# Altium project MEZZANINE-BOARD.PrjPcb
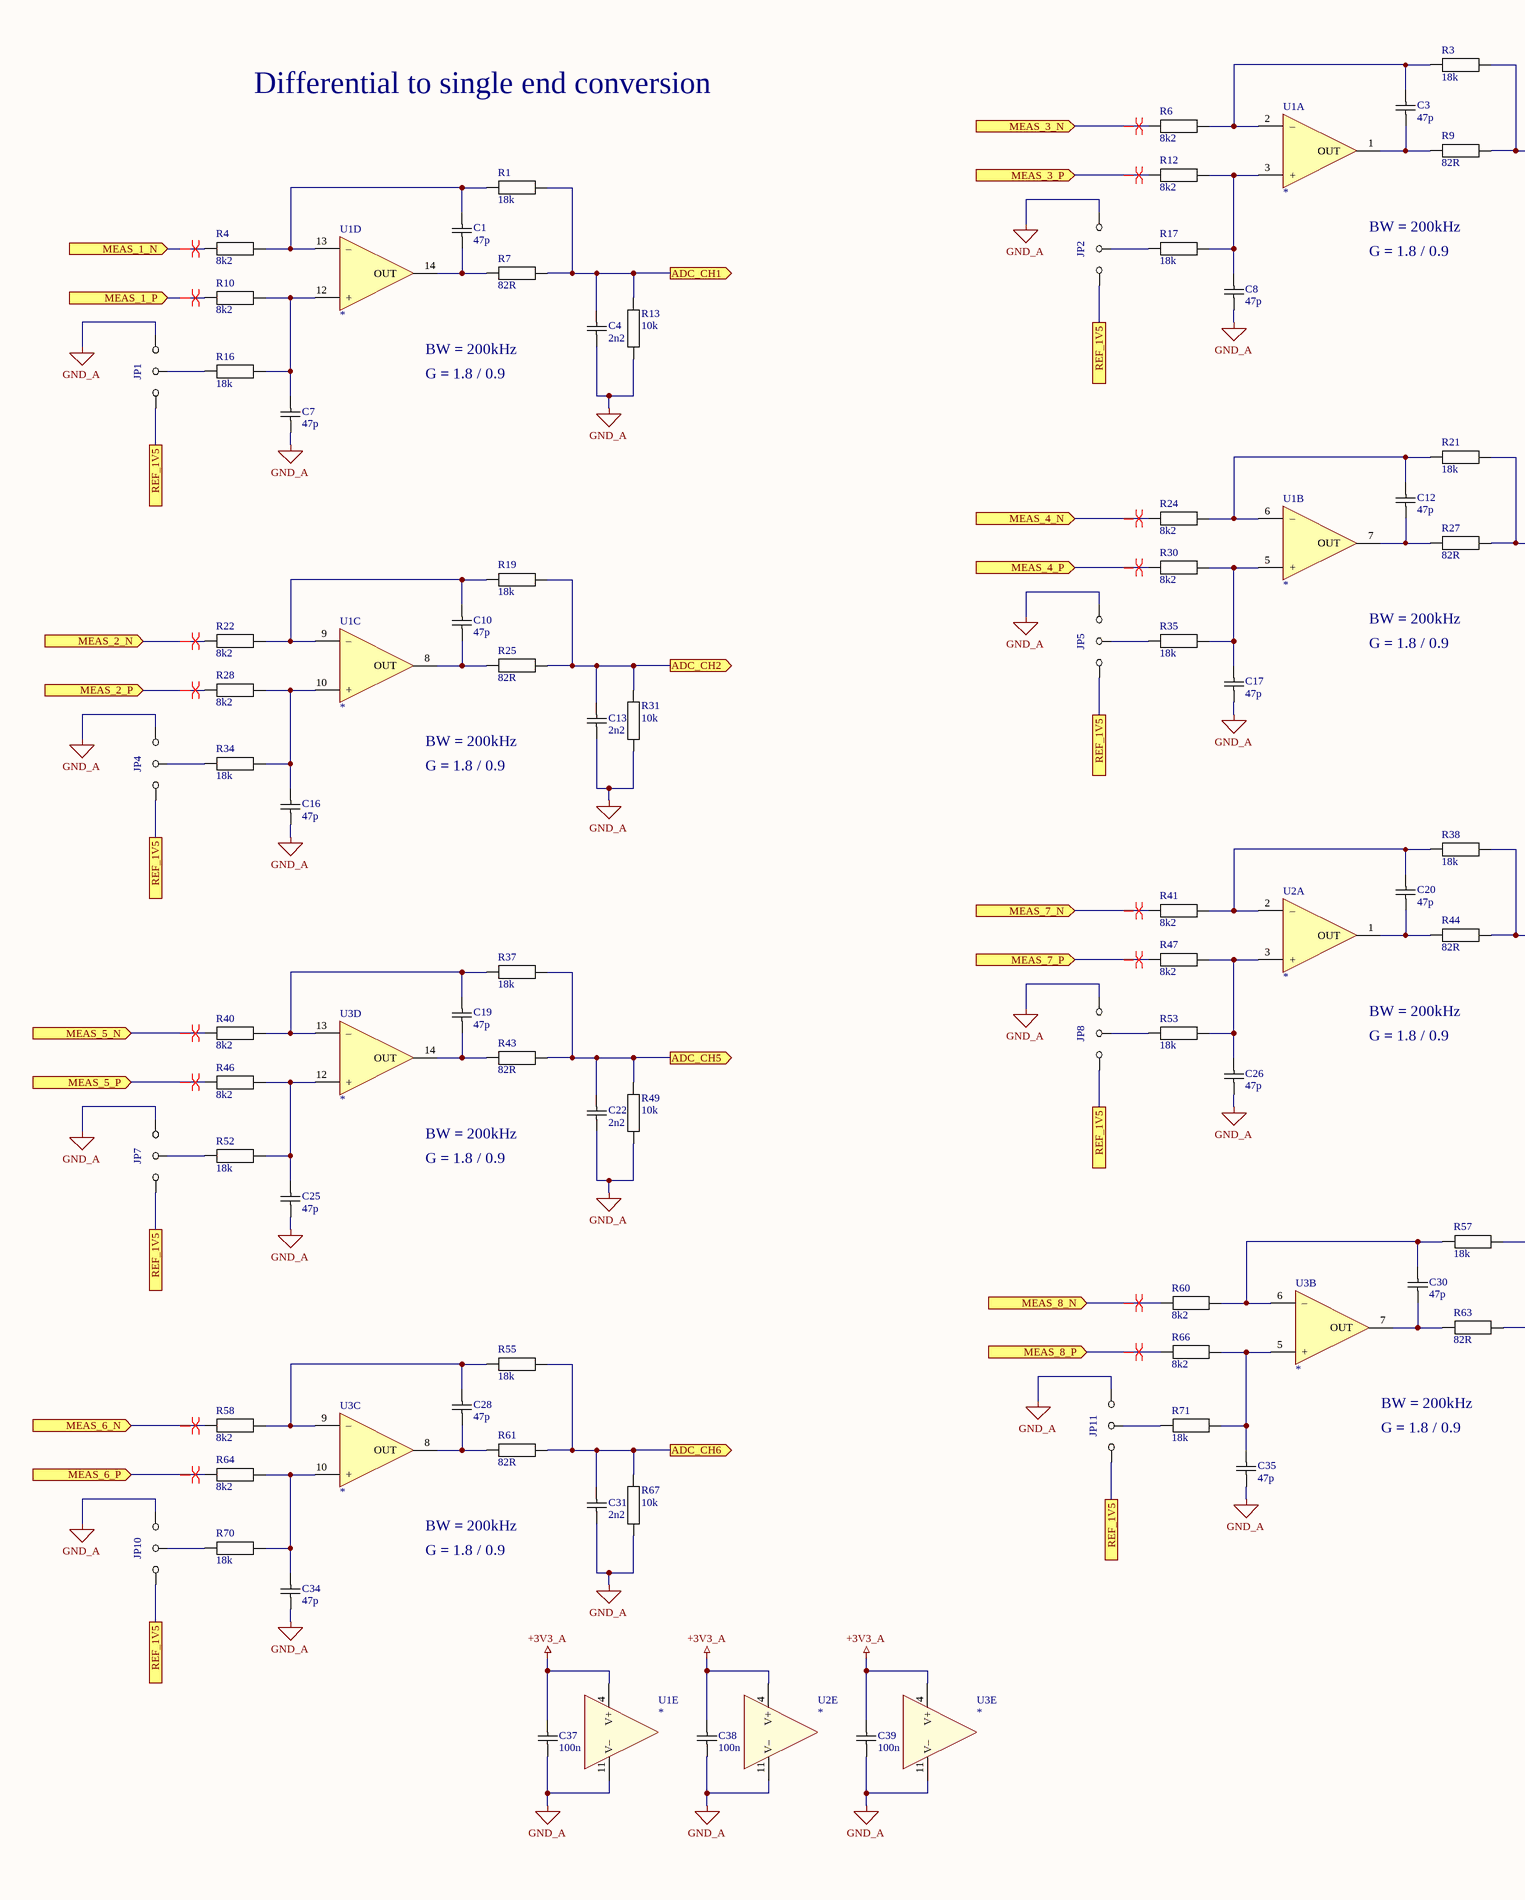
[diagram p0: AD_0.SchDoc, left]
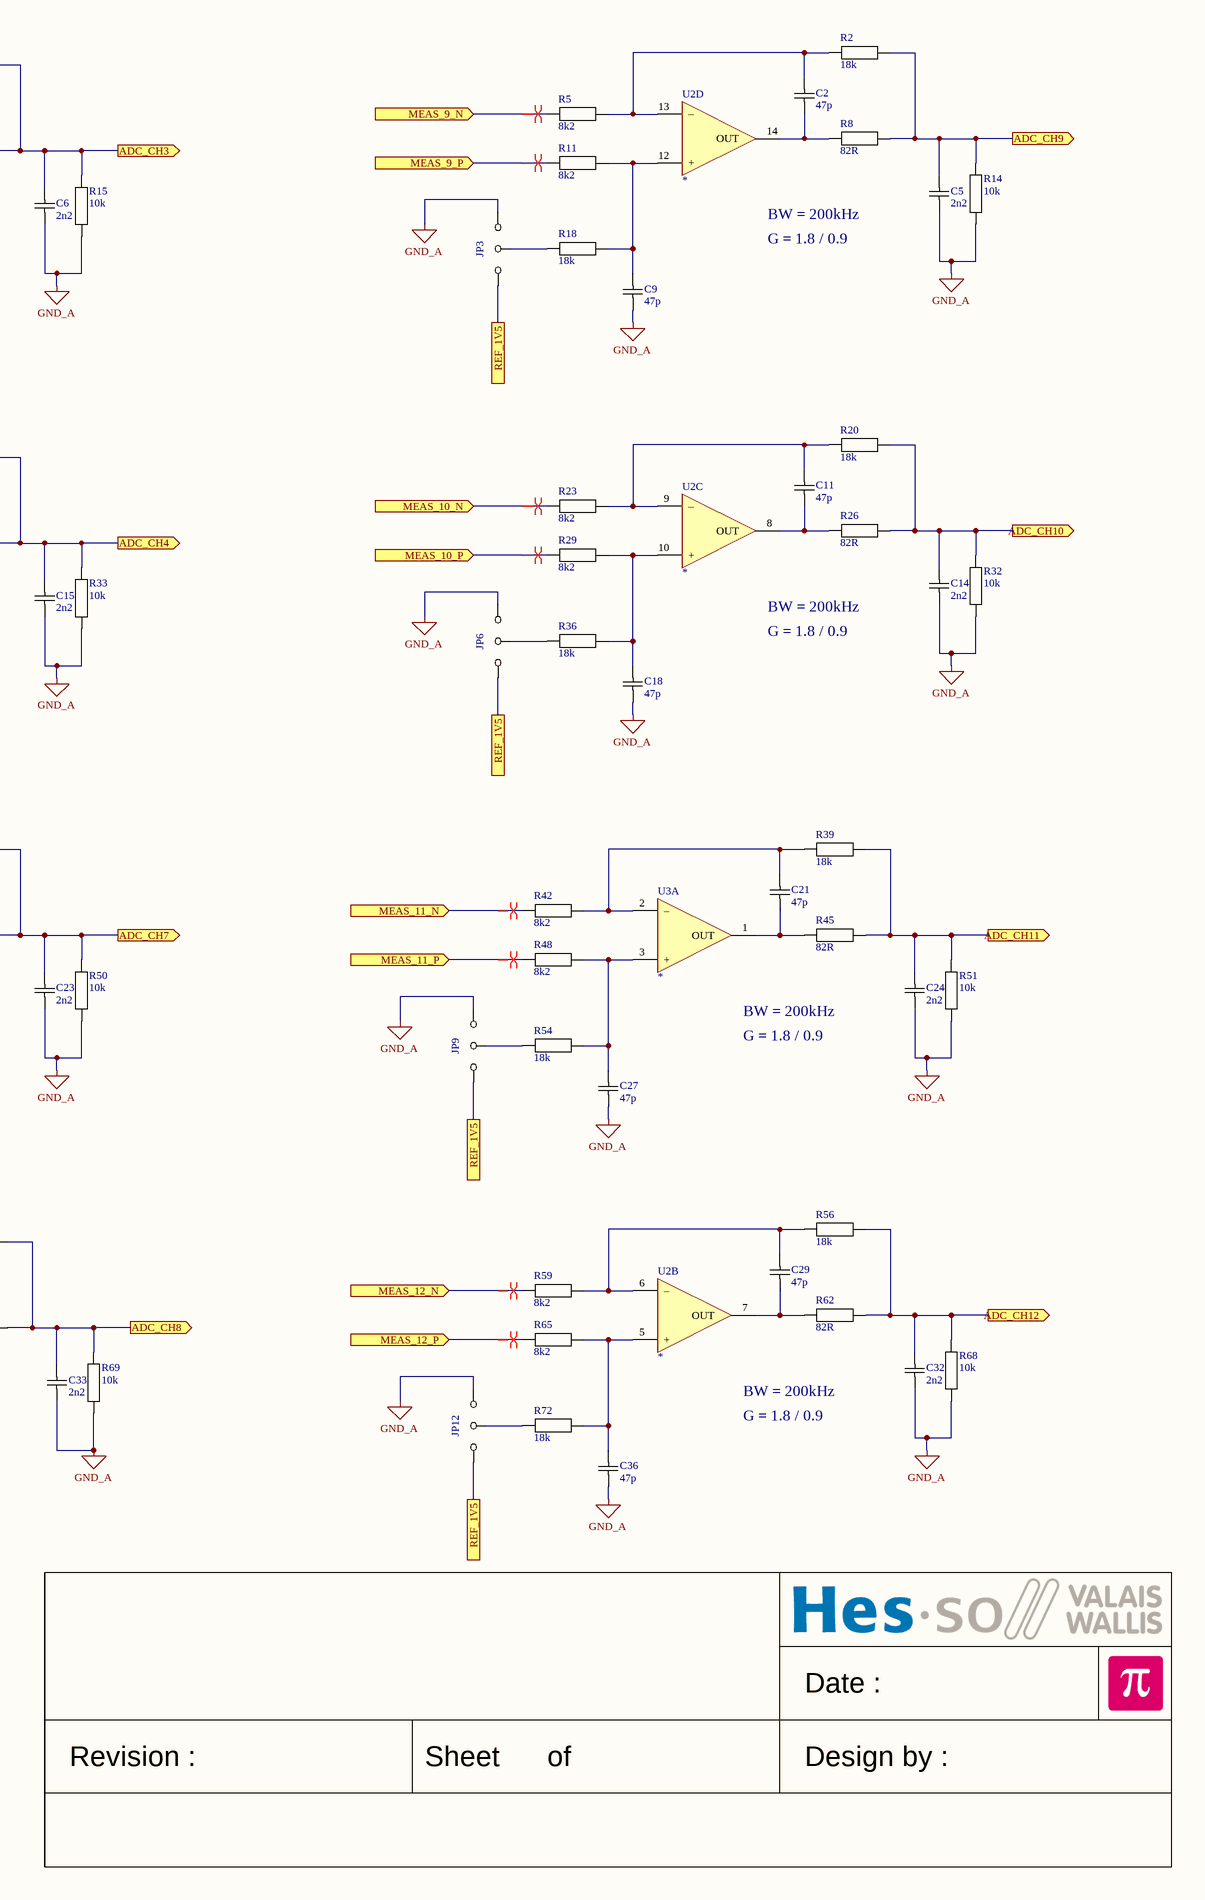
[diagram p1: AD_0.SchDoc, right]
6 sheets, 361 parts. Net scope: flat (ports and power ports of the same name join across sheets).
Board file: PCB-Mezzanine.PcbDoc
Sheets:
  AD_0.SchDoc
  AD_1.SchDoc
  AD_3.SchDoc
  Connector_0.SchDoc
  Supply_0.SchDoc
  DAC_0.SchDoc

## Sheet AD_0.SchDoc
size A2; Date: Date; CompanyName: HESSO; Engineer: Name; Address1: Route du Rawyl 47; Address2: 1950 Sion; Address3: Switzerland; ProjectName: Project Name

### Parts
C1  47p  [CAPACITOR 1608 REFLOW]
C2  47p  [CAPACITOR 1608 REFLOW]
C3  47p  [CAPACITOR 1608 REFLOW]
C4  2n2  [CAPACITOR 1608 REFLOW]
C5  2n2  [CAPACITOR 1608 REFLOW]
C6  2n2  [CAPACITOR 1608 REFLOW]
C7  47p  [CAPACITOR 1608 REFLOW]
C8  47p  [CAPACITOR 1608 REFLOW]
C9  47p  [CAPACITOR 1608 REFLOW]
C10  47p  [CAPACITOR 1608 REFLOW]
C11  47p  [CAPACITOR 1608 REFLOW]
C12  47p  [CAPACITOR 1608 REFLOW]
C13  2n2  [CAPACITOR 1608 REFLOW]
C14  2n2  [CAPACITOR 1608 REFLOW]
C15  2n2  [CAPACITOR 1608 REFLOW]
C16  47p  [CAPACITOR 1608 REFLOW]
C17  47p  [CAPACITOR 1608 REFLOW]
C18  47p  [CAPACITOR 1608 REFLOW]
C19  47p  [CAPACITOR 1608 REFLOW]
C20  47p  [CAPACITOR 1608 REFLOW]
C21  47p  [CAPACITOR 1608 REFLOW]
C22  2n2  [CAPACITOR 1608 REFLOW]
C23  2n2  [CAPACITOR 1608 REFLOW]
C24  2n2  [CAPACITOR 1608 REFLOW]
C25  47p  [CAPACITOR 1608 REFLOW]
C26  47p  [CAPACITOR 1608 REFLOW]
C27  47p  [CAPACITOR 1608 REFLOW]
C28  47p  [CAPACITOR 1608 REFLOW]
C29  47p  [CAPACITOR 1608 REFLOW]
C30  47p  [CAPACITOR 1608 REFLOW]
C31  2n2  [CAPACITOR 1608 REFLOW]
C32  2n2  [CAPACITOR 1608 REFLOW]
C33  2n2  [CAPACITOR 1608 REFLOW]
C34  47p  [CAPACITOR 1608 REFLOW]
C35  47p  [CAPACITOR 1608 REFLOW]
C36  47p  [CAPACITOR 1608 REFLOW]
C37  100n  [CAPACITOR 1608 REFLOW]
C38  100n  [CAPACITOR 1608 REFLOW]
C39  100n  [CAPACITOR 1608 REFLOW]
JP1  {Value}  [JUMPER3 SMD 1608]  (value not drawn)
JP2  {Value}  [JUMPER3 SMD 1608]  (value not drawn)
JP3  {Value}  [JUMPER3 SMD 1608]  (value not drawn)
JP4  {Value}  [JUMPER3 SMD 1608]  (value not drawn)
JP5  {Value}  [JUMPER3 SMD 1608]  (value not drawn)
JP6  {Value}  [JUMPER3 SMD 1608]  (value not drawn)
JP7  {Value}  [JUMPER3 SMD 1608]  (value not drawn)
JP8  {Value}  [JUMPER3 SMD 1608]  (value not drawn)
JP9  {Value}  [JUMPER3 SMD 1608]  (value not drawn)
JP10  {Value}  [JUMPER3 SMD 1608]  (value not drawn)
JP11  {Value}  [JUMPER3 SMD 1608]  (value not drawn)
JP12  {Value}  [JUMPER3 SMD 1608]  (value not drawn)
R1  18k  [RESISTOR 1608 REFLOW]
R2  18k  [RESISTOR 1608 REFLOW]
R3  18k  [RESISTOR 1608 REFLOW]
R4  8k2  [RESISTOR 1608 REFLOW]
R5  8k2  [RESISTOR 1608 REFLOW]
R6  8k2  [RESISTOR 1608 REFLOW]
R7  82R  [RESISTOR 1608 REFLOW]
R8  82R  [RESISTOR 1608 REFLOW]
R9  82R  [RESISTOR 1608 REFLOW]
R10  8k2  [RESISTOR 1608 REFLOW]
R11  8k2  [RESISTOR 1608 REFLOW]
R12  8k2  [RESISTOR 1608 REFLOW]
R13  10k  [RESISTOR 1608 REFLOW]
R14  10k  [RESISTOR 1608 REFLOW]
R15  10k  [RESISTOR 1608 REFLOW]
R16  18k  [RESISTOR 1608 REFLOW]
R17  18k  [RESISTOR 1608 REFLOW]
R18  18k  [RESISTOR 1608 REFLOW]
R19  18k  [RESISTOR 1608 REFLOW]
R20  18k  [RESISTOR 1608 REFLOW]
R21  18k  [RESISTOR 1608 REFLOW]
R22  8k2  [RESISTOR 1608 REFLOW]
R23  8k2  [RESISTOR 1608 REFLOW]
R24  8k2  [RESISTOR 1608 REFLOW]
R25  82R  [RESISTOR 1608 REFLOW]
R26  82R  [RESISTOR 1608 REFLOW]
R27  82R  [RESISTOR 1608 REFLOW]
R28  8k2  [RESISTOR 1608 REFLOW]
R29  8k2  [RESISTOR 1608 REFLOW]
R30  8k2  [RESISTOR 1608 REFLOW]
R31  10k  [RESISTOR 1608 REFLOW]
R32  10k  [RESISTOR 1608 REFLOW]
R33  10k  [RESISTOR 1608 REFLOW]
R34  18k  [RESISTOR 1608 REFLOW]
R35  18k  [RESISTOR 1608 REFLOW]
R36  18k  [RESISTOR 1608 REFLOW]
R37  18k  [RESISTOR 1608 REFLOW]
R38  18k  [RESISTOR 1608 REFLOW]
R39  18k  [RESISTOR 1608 REFLOW]
R40  8k2  [RESISTOR 1608 REFLOW]
R41  8k2  [RESISTOR 1608 REFLOW]
R42  8k2  [RESISTOR 1608 REFLOW]
R43  82R  [RESISTOR 1608 REFLOW]
R44  82R  [RESISTOR 1608 REFLOW]
R45  82R  [RESISTOR 1608 REFLOW]
R46  8k2  [RESISTOR 1608 REFLOW]
R47  8k2  [RESISTOR 1608 REFLOW]
R48  8k2  [RESISTOR 1608 REFLOW]
R49  10k  [RESISTOR 1608 REFLOW]
R50  10k  [RESISTOR 1608 REFLOW]
R51  10k  [RESISTOR 1608 REFLOW]
R52  18k  [RESISTOR 1608 REFLOW]
R53  18k  [RESISTOR 1608 REFLOW]
R54  18k  [RESISTOR 1608 REFLOW]
R55  18k  [RESISTOR 1608 REFLOW]
R56  18k  [RESISTOR 1608 REFLOW]
R57  18k  [RESISTOR 1608 REFLOW]
R58  8k2  [RESISTOR 1608 REFLOW]
R59  8k2  [RESISTOR 1608 REFLOW]
R60  8k2  [RESISTOR 1608 REFLOW]
R61  82R  [RESISTOR 1608 REFLOW]
R62  82R  [RESISTOR 1608 REFLOW]
R63  82R  [RESISTOR 1608 REFLOW]
R64  8k2  [RESISTOR 1608 REFLOW]
R65  8k2  [RESISTOR 1608 REFLOW]
R66  8k2  [RESISTOR 1608 REFLOW]
R67  10k  [RESISTOR 1608 REFLOW]
R68  10k  [RESISTOR 1608 REFLOW]
R69  10k  [RESISTOR 1608 REFLOW]
R70  18k  [RESISTOR 1608 REFLOW]
R71  18k  [RESISTOR 1608 REFLOW]
R72  18k  [RESISTOR 1608 REFLOW]
U1  *  [SO14 P1.27 C4.0X8.8 H1.75]  (parts A,B,C,D,E of 5)
U2  *  [SO14 P1.27 C4.0X8.8 H1.75]  (parts A,B,C,D,E of 5)
U3  *  [SO14 P1.27 C4.0X8.8 H1.75]  (parts A,B,C,D,E of 5)

### Ports
ADC_CH1 (out), ADC_CH2 (out), ADC_CH3 (out), ADC_CH4 (out), ADC_CH5 (out), ADC_CH6 (out), ADC_CH7 (out), ADC_CH8 (out), ADC_CH9 (out), ADC_CH10 (out), ADC_CH11 (out), ADC_CH12 (out), MEAS_1_N (in), MEAS_1_P (in), MEAS_2_N (in), MEAS_2_P (in), MEAS_3_N (in), MEAS_3_P (in), MEAS_4_N (in), MEAS_4_P (in), MEAS_5_N (in), MEAS_5_P (in), MEAS_6_N (in), MEAS_6_P (in), MEAS_7_N (in), MEAS_7_P (in), MEAS_8_N (in), MEAS_8_P (in), MEAS_9_N (in), MEAS_9_P (in), MEAS_10_N (in), MEAS_10_P (in), MEAS_11_N (in), MEAS_11_P (in), MEAS_12_N (in), MEAS_12_P (in), REF_1V5

### Nets
+3V3_A: C37.2 C38.2 C39.2 U1.4(V+) U2.4(V+) U3.4(V+)
GND_A: C4.1 C5.1 C6.1 C7.1 C8.1 C9.1 C13.1 C14.1 C15.1 C16.1 C17.1 C18.1 C22.1 C23.1 C24.1 C25.1 C26.1 C27.1 C31.1 C32.1 C33.1 C34.1 C35.1 C36.1 C37.1 C38.1 C39.1 JP1.3 JP2.3 JP3.3 JP4.3 JP5.3 JP6.3 JP7.3 JP8.3 JP9.3 JP10.3 JP11.3 JP12.3 R13.2 R14.2 R15.2 R31.2 R32.2 R33.2 R49.2 R50.2 R51.2 R67.2 R68.2 R69.2 U1.11(V–) U2.11(V–) U3.11(V–)
ADC_CH1: C4.2 R1.2 R7.2 R13.1 ; port ADC_CH1
ADC_CH2: C13.2 R19.2 R25.2 R31.1 ; port ADC_CH2
ADC_CH3: C6.2 R3.2 R9.2 R15.1 ; port ADC_CH3
ADC_CH4: C15.2 R21.2 R27.2 R33.1 ; port ADC_CH4
ADC_CH5: C22.2 R37.2 R43.2 R49.1 ; port ADC_CH5
ADC_CH6: C31.2 R55.2 R61.2 R67.1 ; port ADC_CH6
ADC_CH7: C23.2 R38.2 R44.2 R50.1 ; port ADC_CH7
ADC_CH8: C33.2 R57.2 R63.2 R69.1 ; port ADC_CH8
ADC_CH9: C5.2 R2.2 R8.2 R14.1 ; port ADC_CH9
ADC_CH10: C14.2 R20.2 R26.2 R32.1 ; port ADC_CH10
ADC_CH11: C24.2 R39.2 R45.2 R51.1 ; port ADC_CH11
ADC_CH12: C32.2 R56.2 R62.2 R68.1 ; port ADC_CH12
MEAS_1_N: R4.1 ; port MEAS_1_N
MEAS_1_P: R10.1 ; port MEAS_1_P
MEAS_2_N: R22.1 ; port MEAS_2_N
MEAS_2_P: R28.1 ; port MEAS_2_P
MEAS_3_N: R6.1 ; port MEAS_3_N
MEAS_3_P: R12.1 ; port MEAS_3_P
MEAS_4_N: R24.1 ; port MEAS_4_N
MEAS_4_P: R30.1 ; port MEAS_4_P
MEAS_5_N: R40.1 ; port MEAS_5_N
MEAS_5_P: R46.1 ; port MEAS_5_P
MEAS_6_N: R58.1 ; port MEAS_6_N
MEAS_6_P: R64.1 ; port MEAS_6_P
MEAS_7_N: R41.1 ; port MEAS_7_N
MEAS_7_P: R47.1 ; port MEAS_7_P
MEAS_8_N: R60.1 ; port MEAS_8_N
MEAS_8_P: R66.1 ; port MEAS_8_P
MEAS_9_N: R5.1 ; port MEAS_9_N
MEAS_9_P: R11.1 ; port MEAS_9_P
MEAS_10_N: R23.1 ; port MEAS_10_N
MEAS_10_P: R29.1 ; port MEAS_10_P
MEAS_11_N: R42.1 ; port MEAS_11_N
MEAS_11_P: R48.1 ; port MEAS_11_P
MEAS_12_N: R59.1 ; port MEAS_12_N
MEAS_12_P: R65.1 ; port MEAS_12_P
REF_1V5: JP1.1 JP2.1 JP3.1 JP4.1 JP5.1 JP6.1 JP7.1 JP8.1 JP9.1 JP10.1 JP11.1 JP12.1 ; port REF_1V5
NetC1_1: C1.1 R7.1 U1.14(OUT)
NetC1_2: C1.2 R1.1 R4.2 U1.13(–)
NetC2_1: C2.1 R8.1 U2.14(OUT)
NetC2_2: C2.2 R2.1 R5.2 U2.13(–)
NetC3_1: C3.1 R9.1 U1.1(OUT)
NetC3_2: C3.2 R3.1 R6.2 U1.2(–)
NetC7_2: C7.2 R10.2 R16.1 U1.12(+)
NetC8_2: C8.2 R12.2 R17.1 U1.3(+)
NetC9_2: C9.2 R11.2 R18.1 U2.12(+)
NetC10_1: C10.1 R25.1 U1.8(OUT)
NetC10_2: C10.2 R19.1 R22.2 U1.9(–)
NetC11_1: C11.1 R26.1 U2.8(OUT)
NetC11_2: C11.2 R20.1 R23.2 U2.9(–)
NetC12_1: C12.1 R27.1 U1.7(OUT)
NetC12_2: C12.2 R21.1 R24.2 U1.6(–)
NetC16_2: C16.2 R28.2 R34.1 U1.10(+)
NetC17_2: C17.2 R30.2 R35.1 U1.5(+)
NetC18_2: C18.2 R29.2 R36.1 U2.10(+)
NetC19_1: C19.1 R43.1 U3.14(OUT)
NetC19_2: C19.2 R37.1 R40.2 U3.13(–)
NetC20_1: C20.1 R44.1 U2.1(OUT)
NetC20_2: C20.2 R38.1 R41.2 U2.2(–)
NetC21_1: C21.1 R45.1 U3.1(OUT)
NetC21_2: C21.2 R39.1 R42.2 U3.2(–)
NetC25_2: C25.2 R46.2 R52.1 U3.12(+)
NetC26_2: C26.2 R47.2 R53.1 U2.3(+)
NetC27_2: C27.2 R48.2 R54.1 U3.3(+)
NetC28_1: C28.1 R61.1 U3.8(OUT)
NetC28_2: C28.2 R55.1 R58.2 U3.9(–)
NetC29_1: C29.1 R62.1 U2.7(OUT)
NetC29_2: C29.2 R56.1 R59.2 U2.6(–)
NetC30_1: C30.1 R63.1 U3.7(OUT)
NetC30_2: C30.2 R57.1 R60.2 U3.6(–)
NetC34_2: C34.2 R64.2 R70.1 U3.10(+)
NetC35_2: C35.2 R66.2 R71.1 U3.5(+)
NetC36_2: C36.2 R65.2 R72.1 U2.5(+)
NetJP1_2: JP1.2 R16.2
NetJP2_2: JP2.2 R17.2
NetJP3_2: JP3.2 R18.2
NetJP4_2: JP4.2 R34.2
NetJP5_2: JP5.2 R35.2
NetJP6_2: JP6.2 R36.2
NetJP7_2: JP7.2 R52.2
NetJP8_2: JP8.2 R53.2
NetJP9_2: JP9.2 R54.2
NetJP10_2: JP10.2 R70.2
NetJP11_2: JP11.2 R71.2
NetJP12_2: JP12.2 R72.2

### Layout directives
differential pair: MEAS_1_N, MEAS_1_P, MEAS_2_N, MEAS_2_P, MEAS_3_N, MEAS_3_P, MEAS_4_N, MEAS_4_P, MEAS_5_N, MEAS_5_P, MEAS_6_N, MEAS_6_P, MEAS_7_N, MEAS_7_P, MEAS_8_N, MEAS_8_P, MEAS_9_N, MEAS_9_P, MEAS_10_N, MEAS_10_P, MEAS_11_N, MEAS_11_P, MEAS_12_N, MEAS_12_P

### Notes on the sheet
- Differential to single end conversion
- BW = 200kHz
- G = 1.8 / 0.9
- Date :
- Revision :
- Sheet
- of
- Design by :

### Library data of the parts
C1-C39 = Capacitor: Capacitor X7R 10% 50V 1608(0603)
  C1-C3 C7-C12 C16-C21 C25-C30 C34-C36: Value: 47p
  C4-C6 C13-C15 C22-C24 C31-C33: Value: 2n2
  C37-C39: Value: 100n
JP1-JP12 = JUMPER 3 POS: Value: {Value}
R1-R72 = Resistor: Resistor 1% 50V 100mW 1608(0603)
  R1-R3 R16-R21 R34-R39 R52-R57 R70-R72: Value: 18k
  R4-R6 R10-R12 R22-R24 R28-R30 R40-R42 R46-R48 R58-R60 R64-R66: Value: 8k2
  R7-R9 R25-R27 R43-R45 R61-R63: Value: 82R
  R13-R15 R31-R33 R49-R51 R67-R69: Value: 10k
U1-U3 = OPA QUAD: Generic quad OPA 14 pins; Value: *

## Sheet AD_1.SchDoc
size A2; Date: Date; CompanyName: HESSO; Engineer: Name; Address1: Route du Rawyl 47; Address2: 1950 Sion; Address3: Switzerland; ProjectName: Project Name
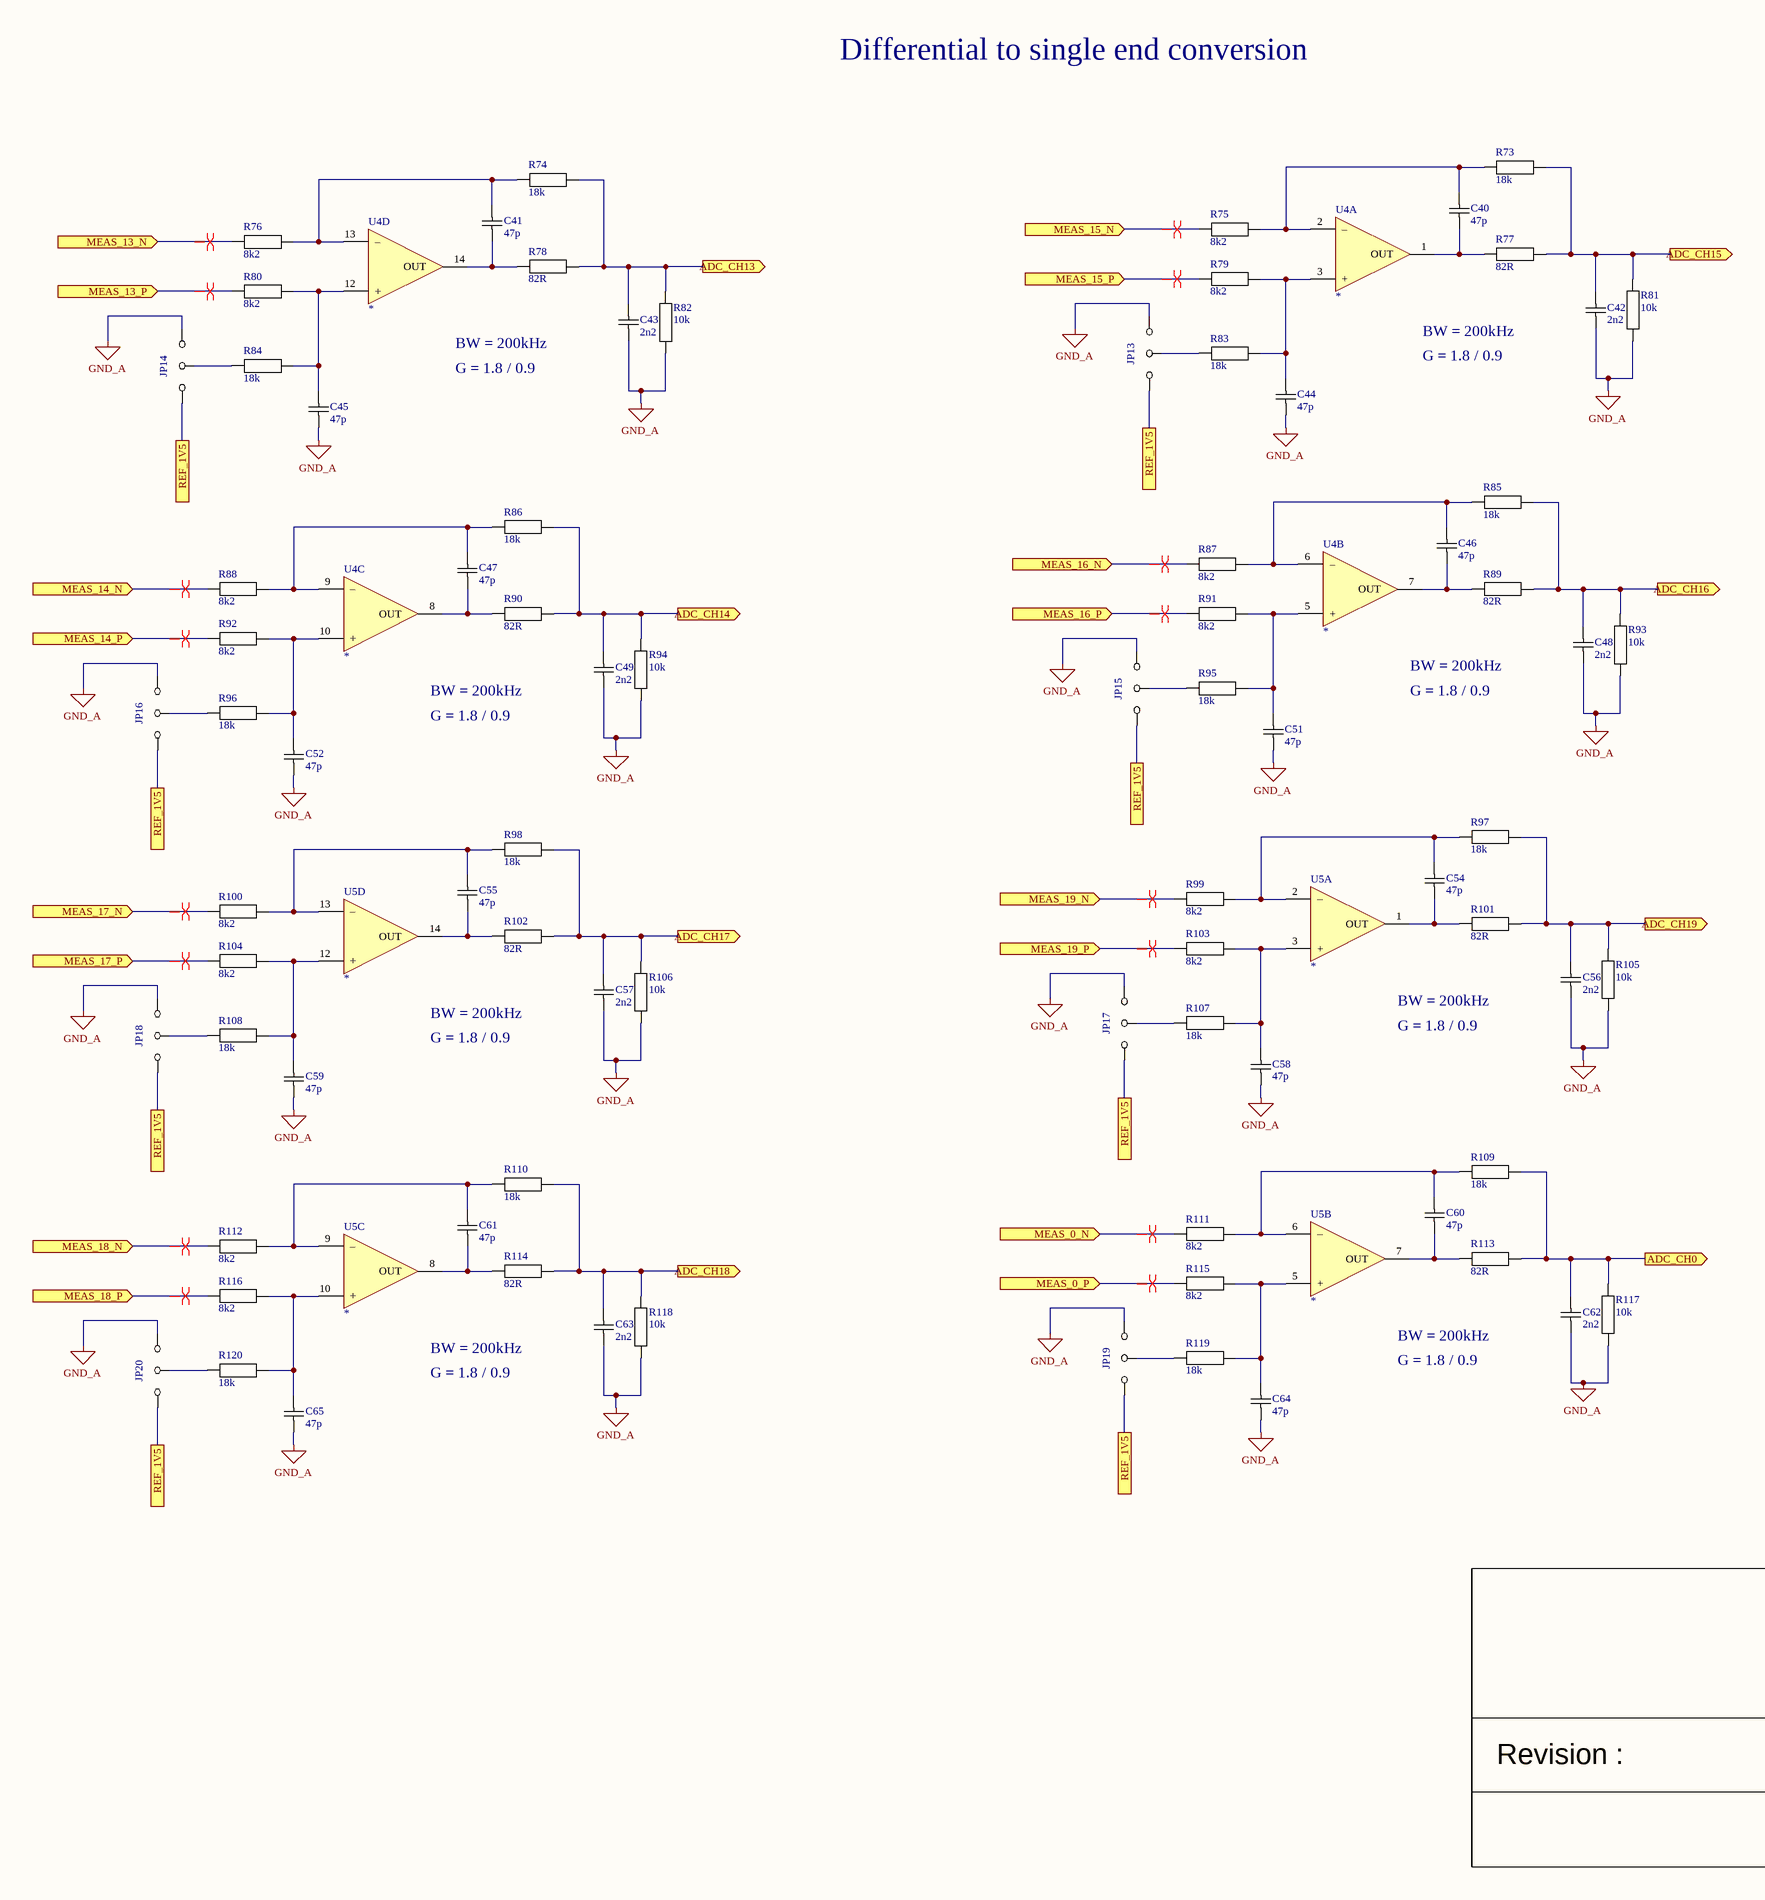
[diagram p2: AD_1.SchDoc, left]
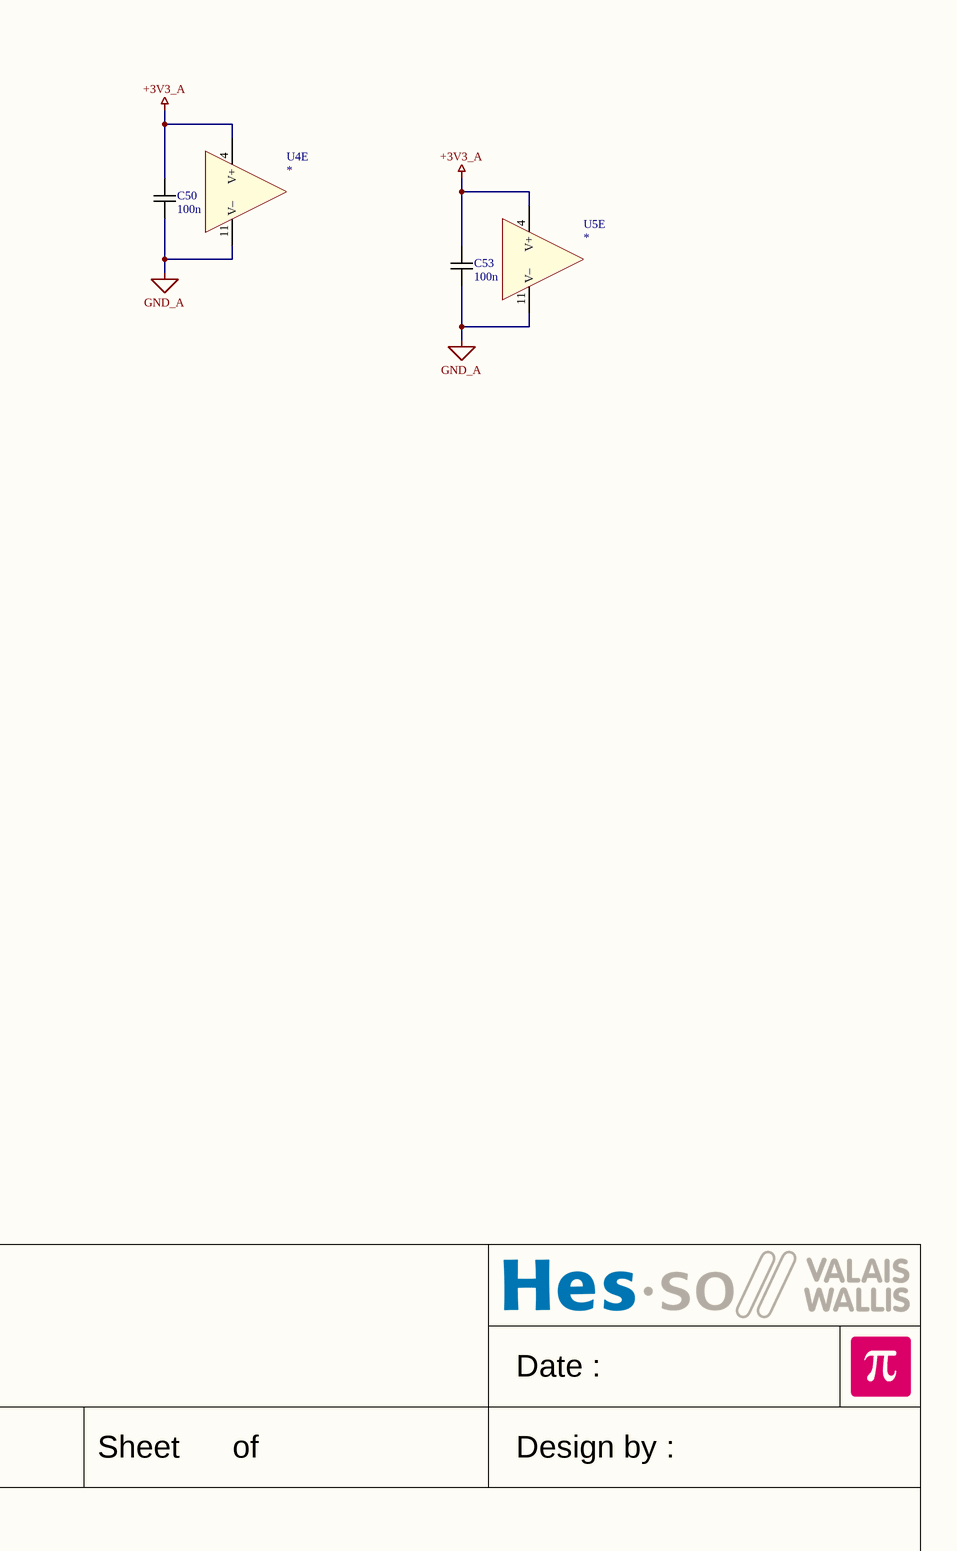
[diagram p3: AD_1.SchDoc, right]

### Parts
C40  47p  [CAPACITOR 1608 REFLOW]
C41  47p  [CAPACITOR 1608 REFLOW]
C42  2n2  [CAPACITOR 1608 REFLOW]
C43  2n2  [CAPACITOR 1608 REFLOW]
C44  47p  [CAPACITOR 1608 REFLOW]
C45  47p  [CAPACITOR 1608 REFLOW]
C46  47p  [CAPACITOR 1608 REFLOW]
C47  47p  [CAPACITOR 1608 REFLOW]
C48  2n2  [CAPACITOR 1608 REFLOW]
C49  2n2  [CAPACITOR 1608 REFLOW]
C50  100n  [CAPACITOR 1608 REFLOW]
C51  47p  [CAPACITOR 1608 REFLOW]
C52  47p  [CAPACITOR 1608 REFLOW]
C53  100n  [CAPACITOR 1608 REFLOW]
C54  47p  [CAPACITOR 1608 REFLOW]
C55  47p  [CAPACITOR 1608 REFLOW]
C56  2n2  [CAPACITOR 1608 REFLOW]
C57  2n2  [CAPACITOR 1608 REFLOW]
C58  47p  [CAPACITOR 1608 REFLOW]
C59  47p  [CAPACITOR 1608 REFLOW]
C60  47p  [CAPACITOR 1608 REFLOW]
C61  47p  [CAPACITOR 1608 REFLOW]
C62  2n2  [CAPACITOR 1608 REFLOW]
C63  2n2  [CAPACITOR 1608 REFLOW]
C64  47p  [CAPACITOR 1608 REFLOW]
C65  47p  [CAPACITOR 1608 REFLOW]
JP13  {Value}  [JUMPER3 SMD 1608]  (value not drawn)
JP14  {Value}  [JUMPER3 SMD 1608]  (value not drawn)
JP15  {Value}  [JUMPER3 SMD 1608]  (value not drawn)
JP16  {Value}  [JUMPER3 SMD 1608]  (value not drawn)
JP17  {Value}  [JUMPER3 SMD 1608]  (value not drawn)
JP18  {Value}  [JUMPER3 SMD 1608]  (value not drawn)
JP19  {Value}  [JUMPER3 SMD 1608]  (value not drawn)
JP20  {Value}  [JUMPER3 SMD 1608]  (value not drawn)
R73  18k  [RESISTOR 1608 REFLOW]
R74  18k  [RESISTOR 1608 REFLOW]
R75  8k2  [RESISTOR 1608 REFLOW]
R76  8k2  [RESISTOR 1608 REFLOW]
R77  82R  [RESISTOR 1608 REFLOW]
R78  82R  [RESISTOR 1608 REFLOW]
R79  8k2  [RESISTOR 1608 REFLOW]
R80  8k2  [RESISTOR 1608 REFLOW]
R81  10k  [RESISTOR 1608 REFLOW]
R82  10k  [RESISTOR 1608 REFLOW]
R83  18k  [RESISTOR 1608 REFLOW]
R84  18k  [RESISTOR 1608 REFLOW]
R85  18k  [RESISTOR 1608 REFLOW]
R86  18k  [RESISTOR 1608 REFLOW]
R87  8k2  [RESISTOR 1608 REFLOW]
R88  8k2  [RESISTOR 1608 REFLOW]
R89  82R  [RESISTOR 1608 REFLOW]
R90  82R  [RESISTOR 1608 REFLOW]
R91  8k2  [RESISTOR 1608 REFLOW]
R92  8k2  [RESISTOR 1608 REFLOW]
R93  10k  [RESISTOR 1608 REFLOW]
R94  10k  [RESISTOR 1608 REFLOW]
R95  18k  [RESISTOR 1608 REFLOW]
R96  18k  [RESISTOR 1608 REFLOW]
R97  18k  [RESISTOR 1608 REFLOW]
R98  18k  [RESISTOR 1608 REFLOW]
R99  8k2  [RESISTOR 1608 REFLOW]
R100  8k2  [RESISTOR 1608 REFLOW]
R101  82R  [RESISTOR 1608 REFLOW]
R102  82R  [RESISTOR 1608 REFLOW]
R103  8k2  [RESISTOR 1608 REFLOW]
R104  8k2  [RESISTOR 1608 REFLOW]
R105  10k  [RESISTOR 1608 REFLOW]
R106  10k  [RESISTOR 1608 REFLOW]
R107  18k  [RESISTOR 1608 REFLOW]
R108  18k  [RESISTOR 1608 REFLOW]
R109  18k  [RESISTOR 1608 REFLOW]
R110  18k  [RESISTOR 1608 REFLOW]
R111  8k2  [RESISTOR 1608 REFLOW]
R112  8k2  [RESISTOR 1608 REFLOW]
R113  82R  [RESISTOR 1608 REFLOW]
R114  82R  [RESISTOR 1608 REFLOW]
R115  8k2  [RESISTOR 1608 REFLOW]
R116  8k2  [RESISTOR 1608 REFLOW]
R117  10k  [RESISTOR 1608 REFLOW]
R118  10k  [RESISTOR 1608 REFLOW]
R119  18k  [RESISTOR 1608 REFLOW]
R120  18k  [RESISTOR 1608 REFLOW]
U4  *  [SO14 P1.27 C4.0X8.8 H1.75]  (parts A,B,C,D,E of 5)
U5  *  [SO14 P1.27 C4.0X8.8 H1.75]  (parts A,B,C,D,E of 5)

### Ports
ADC_CH0 (out), ADC_CH13 (out), ADC_CH14 (out), ADC_CH15 (out), ADC_CH16 (out), ADC_CH17 (out), ADC_CH18 (out), ADC_CH19 (out), MEAS_0_N (in), MEAS_0_P (in), MEAS_13_N (in), MEAS_13_P (in), MEAS_14_N (in), MEAS_14_P (in), MEAS_15_N (in), MEAS_15_P (in), MEAS_16_N (in), MEAS_16_P (in), MEAS_17_N (in), MEAS_17_P (in), MEAS_18_N (in), MEAS_18_P (in), MEAS_19_N (in), MEAS_19_P (in), REF_1V5

### Nets
+3V3_A: C50.2 C53.2 U4.4(V+) U5.4(V+)
GND_A: C42.1 C43.1 C44.1 C45.1 C48.1 C49.1 C50.1 C51.1 C52.1 C53.1 C56.1 C57.1 C58.1 C59.1 C62.1 C63.1 C64.1 C65.1 JP13.3 JP14.3 JP15.3 JP16.3 JP17.3 JP18.3 JP19.3 JP20.3 R81.2 R82.2 R93.2 R94.2 R105.2 R106.2 R117.2 R118.2 U4.11(V–) U5.11(V–)
ADC_CH0: C62.2 R109.2 R113.2 R117.1 ; port ADC_CH0
ADC_CH13: C43.2 R74.2 R78.2 R82.1 ; port ADC_CH13
ADC_CH14: C49.2 R86.2 R90.2 R94.1 ; port ADC_CH14
ADC_CH15: C42.2 R73.2 R77.2 R81.1 ; port ADC_CH15
ADC_CH16: C48.2 R85.2 R89.2 R93.1 ; port ADC_CH16
ADC_CH17: C57.2 R98.2 R102.2 R106.1 ; port ADC_CH17
ADC_CH18: C63.2 R110.2 R114.2 R118.1 ; port ADC_CH18
ADC_CH19: C56.2 R97.2 R101.2 R105.1 ; port ADC_CH19
MEAS_0_N: R111.1 ; port MEAS_0_N
MEAS_0_P: R115.1 ; port MEAS_0_P
MEAS_13_N: R76.1 ; port MEAS_13_N
MEAS_13_P: R80.1 ; port MEAS_13_P
MEAS_14_N: R88.1 ; port MEAS_14_N
MEAS_14_P: R92.1 ; port MEAS_14_P
MEAS_15_N: R75.1 ; port MEAS_15_N
MEAS_15_P: R79.1 ; port MEAS_15_P
MEAS_16_N: R87.1 ; port MEAS_16_N
MEAS_16_P: R91.1 ; port MEAS_16_P
MEAS_17_N: R100.1 ; port MEAS_17_N
MEAS_17_P: R104.1 ; port MEAS_17_P
MEAS_18_N: R112.1 ; port MEAS_18_N
MEAS_18_P: R116.1 ; port MEAS_18_P
MEAS_19_N: R99.1 ; port MEAS_19_N
MEAS_19_P: R103.1 ; port MEAS_19_P
REF_1V5: JP13.1 JP14.1 JP15.1 JP16.1 JP17.1 JP18.1 JP19.1 JP20.1 ; port REF_1V5
NetC40_1: C40.1 R77.1 U4.1(OUT)
NetC40_2: C40.2 R73.1 R75.2 U4.2(–)
NetC41_1: C41.1 R78.1 U4.14(OUT)
NetC41_2: C41.2 R74.1 R76.2 U4.13(–)
NetC44_2: C44.2 R79.2 R83.1 U4.3(+)
NetC45_2: C45.2 R80.2 R84.1 U4.12(+)
NetC46_1: C46.1 R89.1 U4.7(OUT)
NetC46_2: C46.2 R85.1 R87.2 U4.6(–)
NetC47_1: C47.1 R90.1 U4.8(OUT)
NetC47_2: C47.2 R86.1 R88.2 U4.9(–)
NetC51_2: C51.2 R91.2 R95.1 U4.5(+)
NetC52_2: C52.2 R92.2 R96.1 U4.10(+)
NetC54_1: C54.1 R101.1 U5.1(OUT)
NetC54_2: C54.2 R97.1 R99.2 U5.2(–)
NetC55_1: C55.1 R102.1 U5.14(OUT)
NetC55_2: C55.2 R98.1 R100.2 U5.13(–)
NetC58_2: C58.2 R103.2 R107.1 U5.3(+)
NetC59_2: C59.2 R104.2 R108.1 U5.12(+)
NetC60_1: C60.1 R113.1 U5.7(OUT)
NetC60_2: C60.2 R109.1 R111.2 U5.6(–)
NetC61_1: C61.1 R114.1 U5.8(OUT)
NetC61_2: C61.2 R110.1 R112.2 U5.9(–)
NetC64_2: C64.2 R115.2 R119.1 U5.5(+)
NetC65_2: C65.2 R116.2 R120.1 U5.10(+)
NetJP13_2: JP13.2 R83.2
NetJP14_2: JP14.2 R84.2
NetJP15_2: JP15.2 R95.2
NetJP16_2: JP16.2 R96.2
NetJP17_2: JP17.2 R107.2
NetJP18_2: JP18.2 R108.2
NetJP19_2: JP19.2 R119.2
NetJP20_2: JP20.2 R120.2

### Layout directives
differential pair: MEAS_0_N, MEAS_0_P, MEAS_13_N, MEAS_13_P, MEAS_14_N, MEAS_14_P, MEAS_15_N, MEAS_15_P, MEAS_16_N, MEAS_16_P, MEAS_17_N, MEAS_17_P, MEAS_18_N, MEAS_18_P, MEAS_19_N, MEAS_19_P

### Notes on the sheet
- Differential to single end conversion
- BW = 200kHz
- G = 1.8 / 0.9
- Date :
- Revision :
- Sheet
- of
- Design by :

### Library data of the parts
C40-C65 = Capacitor: Capacitor X7R 10% 50V 1608(0603)
  C40 C41 C44-C47 C51 C52 C54 C55 C58-C61 C64 C65: Value: 47p
  C42 C43 C48 C49 C56 C57 C62 C63: Value: 2n2
  C50 C53: Value: 100n
JP13-JP20 = JUMPER 3 POS: Value: {Value}
R73-R120 = Resistor: Resistor 1% 50V 100mW 1608(0603)
  R73 R74 R83-R86 R95-R98 R107-R110 R119 R120: Value: 18k
  R75 R76 R79 R80 R87 R88 R91 R92 R99 R100 R103 R104 R111 R112 R115 R116: Value: 8k2
  R77 R78 R89 R90 R101 R102 R113 R114: Value: 82R
  R81 R82 R93 R94 R105 R106 R117 R118: Value: 10k
U4 U5 = OPA QUAD: Generic quad OPA 14 pins; Value: *

## Sheet AD_3.SchDoc
size A2; Date: Date; CompanyName: HESSO; Engineer: Name; Address1: Route du Rawyl 47; Address2: 1950 Sion; Address3: Switzerland; ProjectName: Project Name
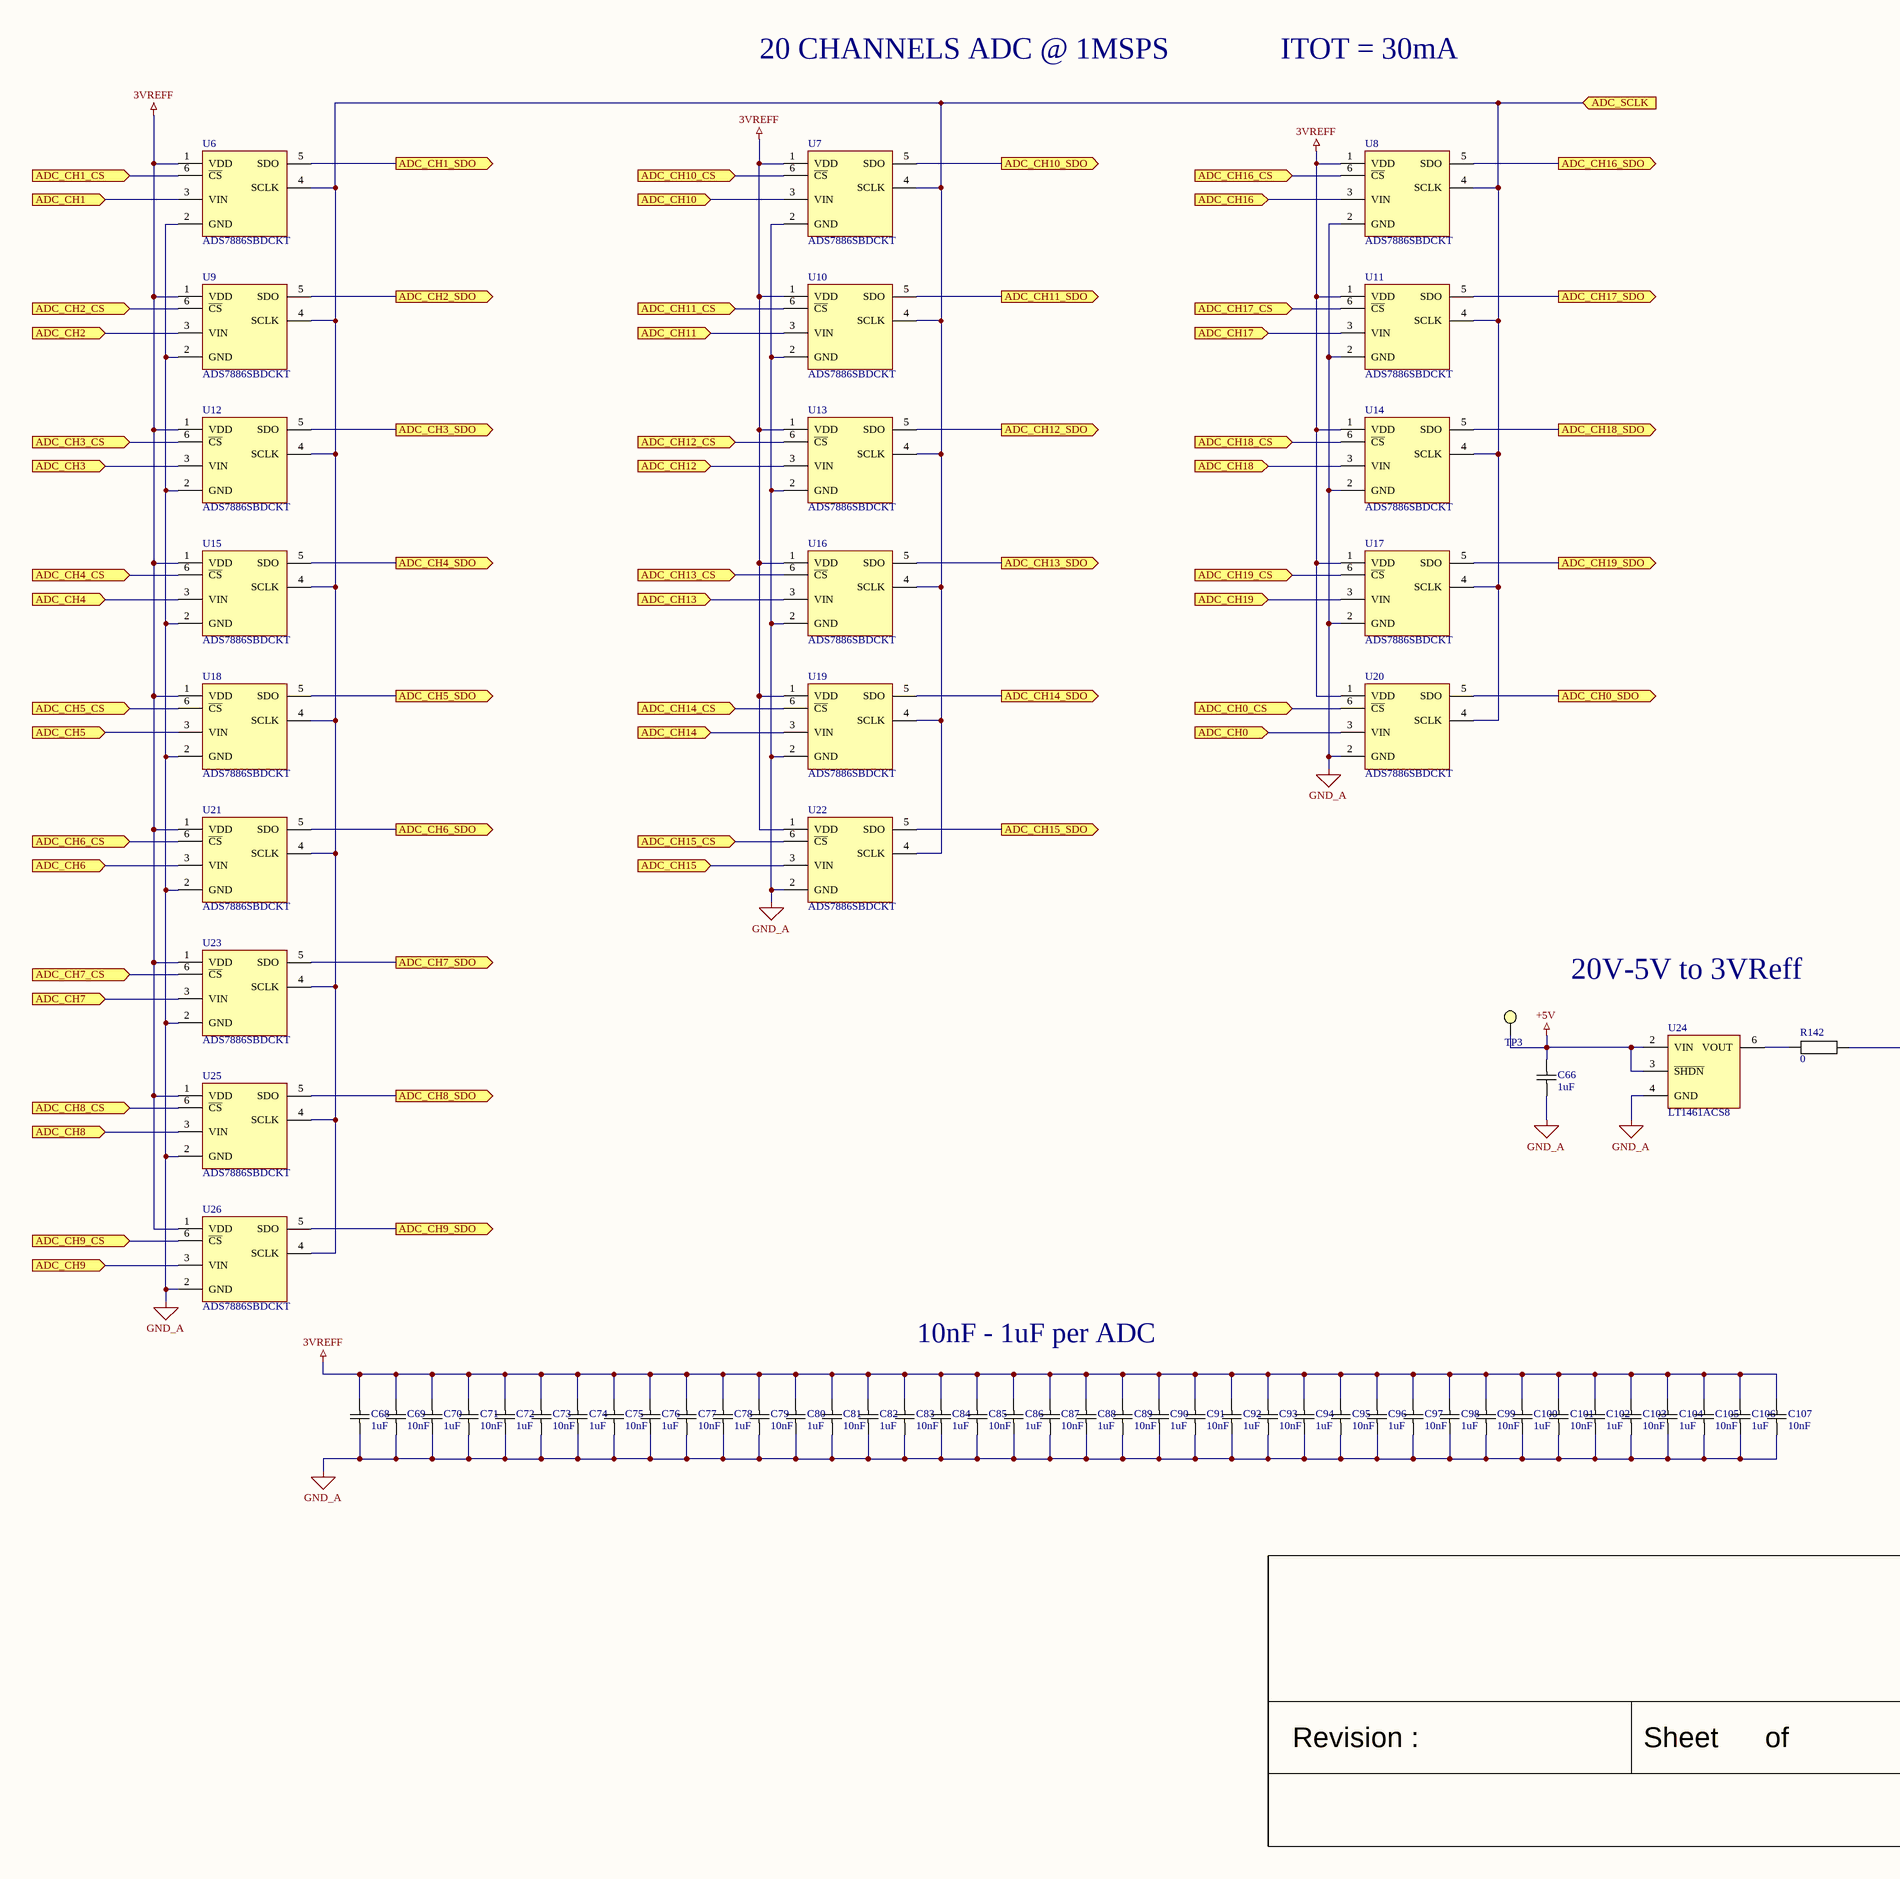
[diagram p4: AD_3.SchDoc, left]
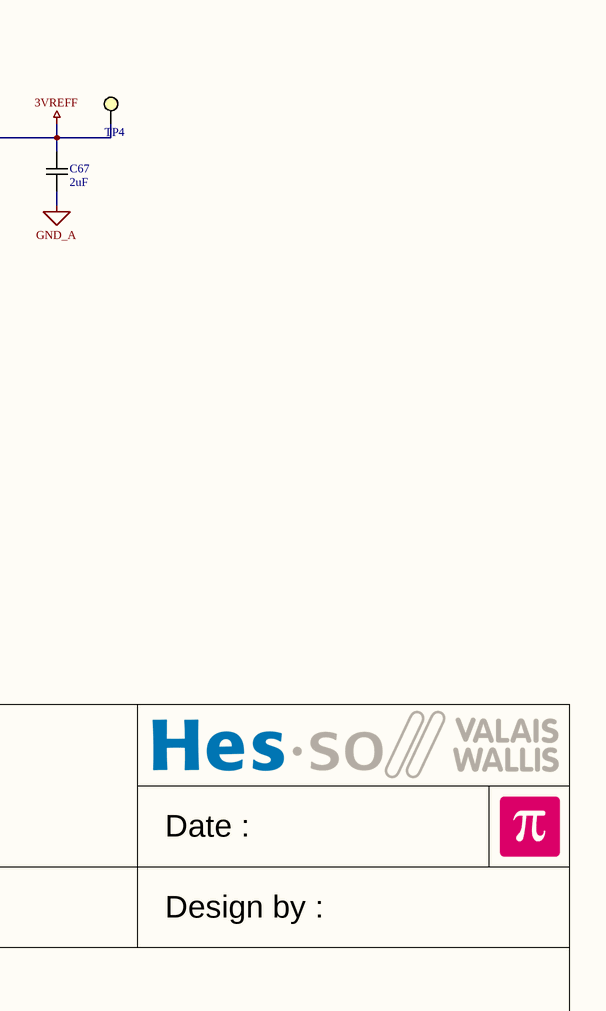
[diagram p5: AD_3.SchDoc, right]

### Parts
C66  1uF  [CAPACITOR 1608 REFLOW]
C67  2uF  [CAPACITOR 1608 REFLOW]
C68  1uF  [CAPACITOR 1608 REFLOW]
C69  10nF  [CAPACITOR 1608 REFLOW]
C70  1uF  [CAPACITOR 1608 REFLOW]
C71  10nF  [CAPACITOR 1608 REFLOW]
C72  1uF  [CAPACITOR 1608 REFLOW]
C73  10nF  [CAPACITOR 1608 REFLOW]
C74  1uF  [CAPACITOR 1608 REFLOW]
C75  10nF  [CAPACITOR 1608 REFLOW]
C76  1uF  [CAPACITOR 1608 REFLOW]
C77  10nF  [CAPACITOR 1608 REFLOW]
C78  1uF  [CAPACITOR 1608 REFLOW]
C79  10nF  [CAPACITOR 1608 REFLOW]
C80  1uF  [CAPACITOR 1608 REFLOW]
C81  10nF  [CAPACITOR 1608 REFLOW]
C82  1uF  [CAPACITOR 1608 REFLOW]
C83  10nF  [CAPACITOR 1608 REFLOW]
C84  1uF  [CAPACITOR 1608 REFLOW]
C85  10nF  [CAPACITOR 1608 REFLOW]
C86  1uF  [CAPACITOR 1608 REFLOW]
C87  10nF  [CAPACITOR 1608 REFLOW]
C88  1uF  [CAPACITOR 1608 REFLOW]
C89  10nF  [CAPACITOR 1608 REFLOW]
C90  1uF  [CAPACITOR 1608 REFLOW]
C91  10nF  [CAPACITOR 1608 REFLOW]
C92  1uF  [CAPACITOR 1608 REFLOW]
C93  10nF  [CAPACITOR 1608 REFLOW]
C94  1uF  [CAPACITOR 1608 REFLOW]
C95  10nF  [CAPACITOR 1608 REFLOW]
C96  1uF  [CAPACITOR 1608 REFLOW]
C97  10nF  [CAPACITOR 1608 REFLOW]
C98  1uF  [CAPACITOR 1608 REFLOW]
C99  10nF  [CAPACITOR 1608 REFLOW]
C100  1uF  [CAPACITOR 1608 REFLOW]
C101  10nF  [CAPACITOR 1608 REFLOW]
C102  1uF  [CAPACITOR 1608 REFLOW]
C103  10nF  [CAPACITOR 1608 REFLOW]
C104  1uF  [CAPACITOR 1608 REFLOW]
C105  10nF  [CAPACITOR 1608 REFLOW]
C106  1uF  [CAPACITOR 1608 REFLOW]
C107  10nF  [CAPACITOR 1608 REFLOW]
R142  0  [RESISTOR 1608 REFLOW]
TP3  *  [Test Point Keystone Miniature RED]  (value not drawn)
TP4  *  [Test Point Keystone Miniature RED]  (value not drawn)
U6  ADS7886SBDCKT  [SOT23-6 P0.95 C1.5x3.0 H1.3]
U7  ADS7886SBDCKT  [SOT23-6 P0.95 C1.5x3.0 H1.3]
U8  ADS7886SBDCKT  [SOT23-6 P0.95 C1.5x3.0 H1.3]
U9  ADS7886SBDCKT  [SOT23-6 P0.95 C1.5x3.0 H1.3]
U10  ADS7886SBDCKT  [SOT23-6 P0.95 C1.5x3.0 H1.3]
U11  ADS7886SBDCKT  [SOT23-6 P0.95 C1.5x3.0 H1.3]
U12  ADS7886SBDCKT  [SOT23-6 P0.95 C1.5x3.0 H1.3]
U13  ADS7886SBDCKT  [SOT23-6 P0.95 C1.5x3.0 H1.3]
U14  ADS7886SBDCKT  [SOT23-6 P0.95 C1.5x3.0 H1.3]
U15  ADS7886SBDCKT  [SOT23-6 P0.95 C1.5x3.0 H1.3]
U16  ADS7886SBDCKT  [SOT23-6 P0.95 C1.5x3.0 H1.3]
U17  ADS7886SBDCKT  [SOT23-6 P0.95 C1.5x3.0 H1.3]
U18  ADS7886SBDCKT  [SOT23-6 P0.95 C1.5x3.0 H1.3]
U19  ADS7886SBDCKT  [SOT23-6 P0.95 C1.5x3.0 H1.3]
U20  ADS7886SBDCKT  [SOT23-6 P0.95 C1.5x3.0 H1.3]
U21  ADS7886SBDCKT  [SOT23-6 P0.95 C1.5x3.0 H1.3]
U22  ADS7886SBDCKT  [SOT23-6 P0.95 C1.5x3.0 H1.3]
U23  ADS7886SBDCKT  [SOT23-6 P0.95 C1.5x3.0 H1.3]
U24  LT1461ACS8  [SO8 P1.27 C4.0X5.0 H1.75]
U25  ADS7886SBDCKT  [SOT23-6 P0.95 C1.5x3.0 H1.3]
U26  ADS7886SBDCKT  [SOT23-6 P0.95 C1.5x3.0 H1.3]

### Ports
ADC_CH0 (in), ADC_CH0_CS (in), ADC_CH0_SDO (out), ADC_CH1 (in), ADC_CH1_CS (in), ADC_CH1_SDO (out), ADC_CH2 (in), ADC_CH2_CS (in), ADC_CH2_SDO (out), ADC_CH3 (in), ADC_CH3_CS (in), ADC_CH3_SDO (out), ADC_CH4 (in), ADC_CH4_CS (in), ADC_CH4_SDO (out), ADC_CH5 (in), ADC_CH5_CS (in), ADC_CH5_SDO (out), ADC_CH6 (in), ADC_CH6_CS (in), ADC_CH6_SDO (out), ADC_CH7 (in), ADC_CH7_CS (in), ADC_CH7_SDO (out), ADC_CH8 (in), ADC_CH8_CS (in), ADC_CH8_SDO (out), ADC_CH9 (in), ADC_CH9_CS (in), ADC_CH9_SDO (out), ADC_CH10 (in), ADC_CH10_CS (in), ADC_CH10_SDO (out), ADC_CH11 (in), ADC_CH11_CS (in), ADC_CH11_SDO (out), ADC_CH12 (in), ADC_CH12_CS (in), ADC_CH12_SDO (out), ADC_CH13 (in), ADC_CH13_CS (in), ADC_CH13_SDO (out), ADC_CH14 (in), ADC_CH14_CS (in), ADC_CH14_SDO (out), ADC_CH15 (in), ADC_CH15_CS (in), ADC_CH15_SDO (out), ADC_CH16 (in), ADC_CH16_CS (in), ADC_CH16_SDO (out), ADC_CH17 (in), ADC_CH17_CS (in), ADC_CH17_SDO (out), ADC_CH18 (in), ADC_CH18_CS (in), ADC_CH18_SDO (out), ADC_CH19 (in), ADC_CH19_CS (in), ADC_CH19_SDO (out), ADC_SCLK (in)

### Nets
3VREFF: C67.2 C68.2 C69.2 C70.2 C71.2 C72.2 C73.2 C74.2 C75.2 C76.2 C77.2 C78.2 C79.2 C80.2 C81.2 C82.2 C83.2 C84.2 C85.2 C86.2 C87.2 C88.2 C89.2 C90.2 C91.2 C92.2 C93.2 C94.2 C95.2 C96.2 C97.2 C98.2 C99.2 C100.2 C101.2 C102.2 C103.2 C104.2 C105.2 C106.2 C107.2 R142.2 TP4.1 U6.1(VDD) U7.1(VDD) U8.1(VDD) U9.1(VDD) U10.1(VDD) U11.1(VDD) U12.1(VDD) U13.1(VDD) U14.1(VDD) U15.1(VDD) U16.1(VDD) U17.1(VDD) U18.1(VDD) U19.1(VDD) U20.1(VDD) U21.1(VDD) U22.1(VDD) U23.1(VDD) U25.1(VDD) U26.1(VDD)
+5V: C66.2 TP3.1 U24.2(VIN) U24.3(~{SHDN})
GND_A: C66.1 C67.1 C68.1 C69.1 C70.1 C71.1 C72.1 C73.1 C74.1 C75.1 C76.1 C77.1 C78.1 C79.1 C80.1 C81.1 C82.1 C83.1 C84.1 C85.1 C86.1 C87.1 C88.1 C89.1 C90.1 C91.1 C92.1 C93.1 C94.1 C95.1 C96.1 C97.1 C98.1 C99.1 C100.1 C101.1 C102.1 C103.1 C104.1 C105.1 C106.1 C107.1 U6.2(GND) U7.2(GND) U8.2(GND) U9.2(GND) U10.2(GND) U11.2(GND) U12.2(GND) U13.2(GND) U14.2(GND) U15.2(GND) U16.2(GND) U17.2(GND) U18.2(GND) U19.2(GND) U20.2(GND) U21.2(GND) U22.2(GND) U23.2(GND) U24.4(GND) U25.2(GND) U26.2(GND)
ADC_CH0: U20.3(VIN) ; port ADC_CH0
ADC_CH0_CS: U20.6(~{CS}) ; port ADC_CH0_CS
ADC_CH0_SDO: U20.5(SDO) ; port ADC_CH0_SDO
ADC_CH1: U6.3(VIN) ; port ADC_CH1
ADC_CH1_CS: U6.6(~{CS}) ; port ADC_CH1_CS
ADC_CH1_SDO: U6.5(SDO) ; port ADC_CH1_SDO
ADC_CH2: U9.3(VIN) ; port ADC_CH2
ADC_CH2_CS: U9.6(~{CS}) ; port ADC_CH2_CS
ADC_CH2_SDO: U9.5(SDO) ; port ADC_CH2_SDO
ADC_CH3: U12.3(VIN) ; port ADC_CH3
ADC_CH3_CS: U12.6(~{CS}) ; port ADC_CH3_CS
ADC_CH3_SDO: U12.5(SDO) ; port ADC_CH3_SDO
ADC_CH4: U15.3(VIN) ; port ADC_CH4
ADC_CH4_CS: U15.6(~{CS}) ; port ADC_CH4_CS
ADC_CH4_SDO: U15.5(SDO) ; port ADC_CH4_SDO
ADC_CH5: U18.3(VIN) ; port ADC_CH5
ADC_CH5_CS: U18.6(~{CS}) ; port ADC_CH5_CS
ADC_CH5_SDO: U18.5(SDO) ; port ADC_CH5_SDO
ADC_CH6: U21.3(VIN) ; port ADC_CH6
ADC_CH6_CS: U21.6(~{CS}) ; port ADC_CH6_CS
ADC_CH6_SDO: U21.5(SDO) ; port ADC_CH6_SDO
ADC_CH7: U23.3(VIN) ; port ADC_CH7
ADC_CH7_CS: U23.6(~{CS}) ; port ADC_CH7_CS
ADC_CH7_SDO: U23.5(SDO) ; port ADC_CH7_SDO
ADC_CH8: U25.3(VIN) ; port ADC_CH8
ADC_CH8_CS: U25.6(~{CS}) ; port ADC_CH8_CS
ADC_CH8_SDO: U25.5(SDO) ; port ADC_CH8_SDO
ADC_CH9: U26.3(VIN) ; port ADC_CH9
ADC_CH9_CS: U26.6(~{CS}) ; port ADC_CH9_CS
ADC_CH9_SDO: U26.5(SDO) ; port ADC_CH9_SDO
ADC_CH10: U7.3(VIN) ; port ADC_CH10
ADC_CH10_CS: U7.6(~{CS}) ; port ADC_CH10_CS
ADC_CH10_SDO: U7.5(SDO) ; port ADC_CH10_SDO
ADC_CH11: U10.3(VIN) ; port ADC_CH11
ADC_CH11_CS: U10.6(~{CS}) ; port ADC_CH11_CS
ADC_CH11_SDO: U10.5(SDO) ; port ADC_CH11_SDO
ADC_CH12: U13.3(VIN) ; port ADC_CH12
ADC_CH12_CS: U13.6(~{CS}) ; port ADC_CH12_CS
ADC_CH12_SDO: U13.5(SDO) ; port ADC_CH12_SDO
ADC_CH13: U16.3(VIN) ; port ADC_CH13
ADC_CH13_CS: U16.6(~{CS}) ; port ADC_CH13_CS
ADC_CH13_SDO: U16.5(SDO) ; port ADC_CH13_SDO
ADC_CH14: U19.3(VIN) ; port ADC_CH14
ADC_CH14_CS: U19.6(~{CS}) ; port ADC_CH14_CS
ADC_CH14_SDO: U19.5(SDO) ; port ADC_CH14_SDO
ADC_CH15: U22.3(VIN) ; port ADC_CH15
ADC_CH15_CS: U22.6(~{CS}) ; port ADC_CH15_CS
ADC_CH15_SDO: U22.5(SDO) ; port ADC_CH15_SDO
ADC_CH16: U8.3(VIN) ; port ADC_CH16
ADC_CH16_CS: U8.6(~{CS}) ; port ADC_CH16_CS
ADC_CH16_SDO: U8.5(SDO) ; port ADC_CH16_SDO
ADC_CH17: U11.3(VIN) ; port ADC_CH17
ADC_CH17_CS: U11.6(~{CS}) ; port ADC_CH17_CS
ADC_CH17_SDO: U11.5(SDO) ; port ADC_CH17_SDO
ADC_CH18: U14.3(VIN) ; port ADC_CH18
ADC_CH18_CS: U14.6(~{CS}) ; port ADC_CH18_CS
ADC_CH18_SDO: U14.5(SDO) ; port ADC_CH18_SDO
ADC_CH19: U17.3(VIN) ; port ADC_CH19
ADC_CH19_CS: U17.6(~{CS}) ; port ADC_CH19_CS
ADC_CH19_SDO: U17.5(SDO) ; port ADC_CH19_SDO
ADC_SCLK: U6.4(SCLK) U7.4(SCLK) U8.4(SCLK) U9.4(SCLK) U10.4(SCLK) U11.4(SCLK) U12.4(SCLK) U13.4(SCLK) U14.4(SCLK) U15.4(SCLK) U16.4(SCLK) U17.4(SCLK) U18.4(SCLK) U19.4(SCLK) U20.4(SCLK) U21.4(SCLK) U22.4(SCLK) U23.4(SCLK) U25.4(SCLK) U26.4(SCLK) ; port ADC_SCLK
NetR142_1: R142.1 U24.6(VOUT)

### Notes on the sheet
- 20 CHANNELS ADC @ 1MSPS
- ITOT = 30mA
- 20V-5V to 3VReff
- 10nF - 1uF per ADC
- Date :
- Revision :
- Sheet
- of
- Design by :

### Library data of the parts
C66-C107 = Capacitor
  C66 C68 C70 C72 C74 C76 C78 C80 C82 C84 C86 C88 C90 C92 C94 C96 C98 C100 C102 C104 C106: Value: 1uF
  C67: Value: 2uF
  C69 C71 C73 C75 C77 C79 C81 C83 C85 C87 C89 C91 C93 C95 C97 C99 C101 C103 C105 C107: Value: 10nF
R142 = Resistor: Resistor 1% 50V 100mW 1608(0603); Value: 0
TP3 TP4 = Test Point: Value: *
U6-U23 U25 U26 = ADS7886SBDCKT: 12-Bit, 1-MSPS, Micro-Power, Miniature SAR Analog-to-Digital Converters; Value: ADS7886SBDCKT
U24 = LT1461ACS8: Micropower Precision Low Dropout Series Voltage Reference Family; Value: LT1461ACS8

## Sheet Connector_0.SchDoc
size A2; Date: Date; CompanyName: HESSO; Engineer: Name; Address1: Route du Rawyl 47; Address2: 1950 Sion; Address3: Switzerland; ProjectName: Project Name
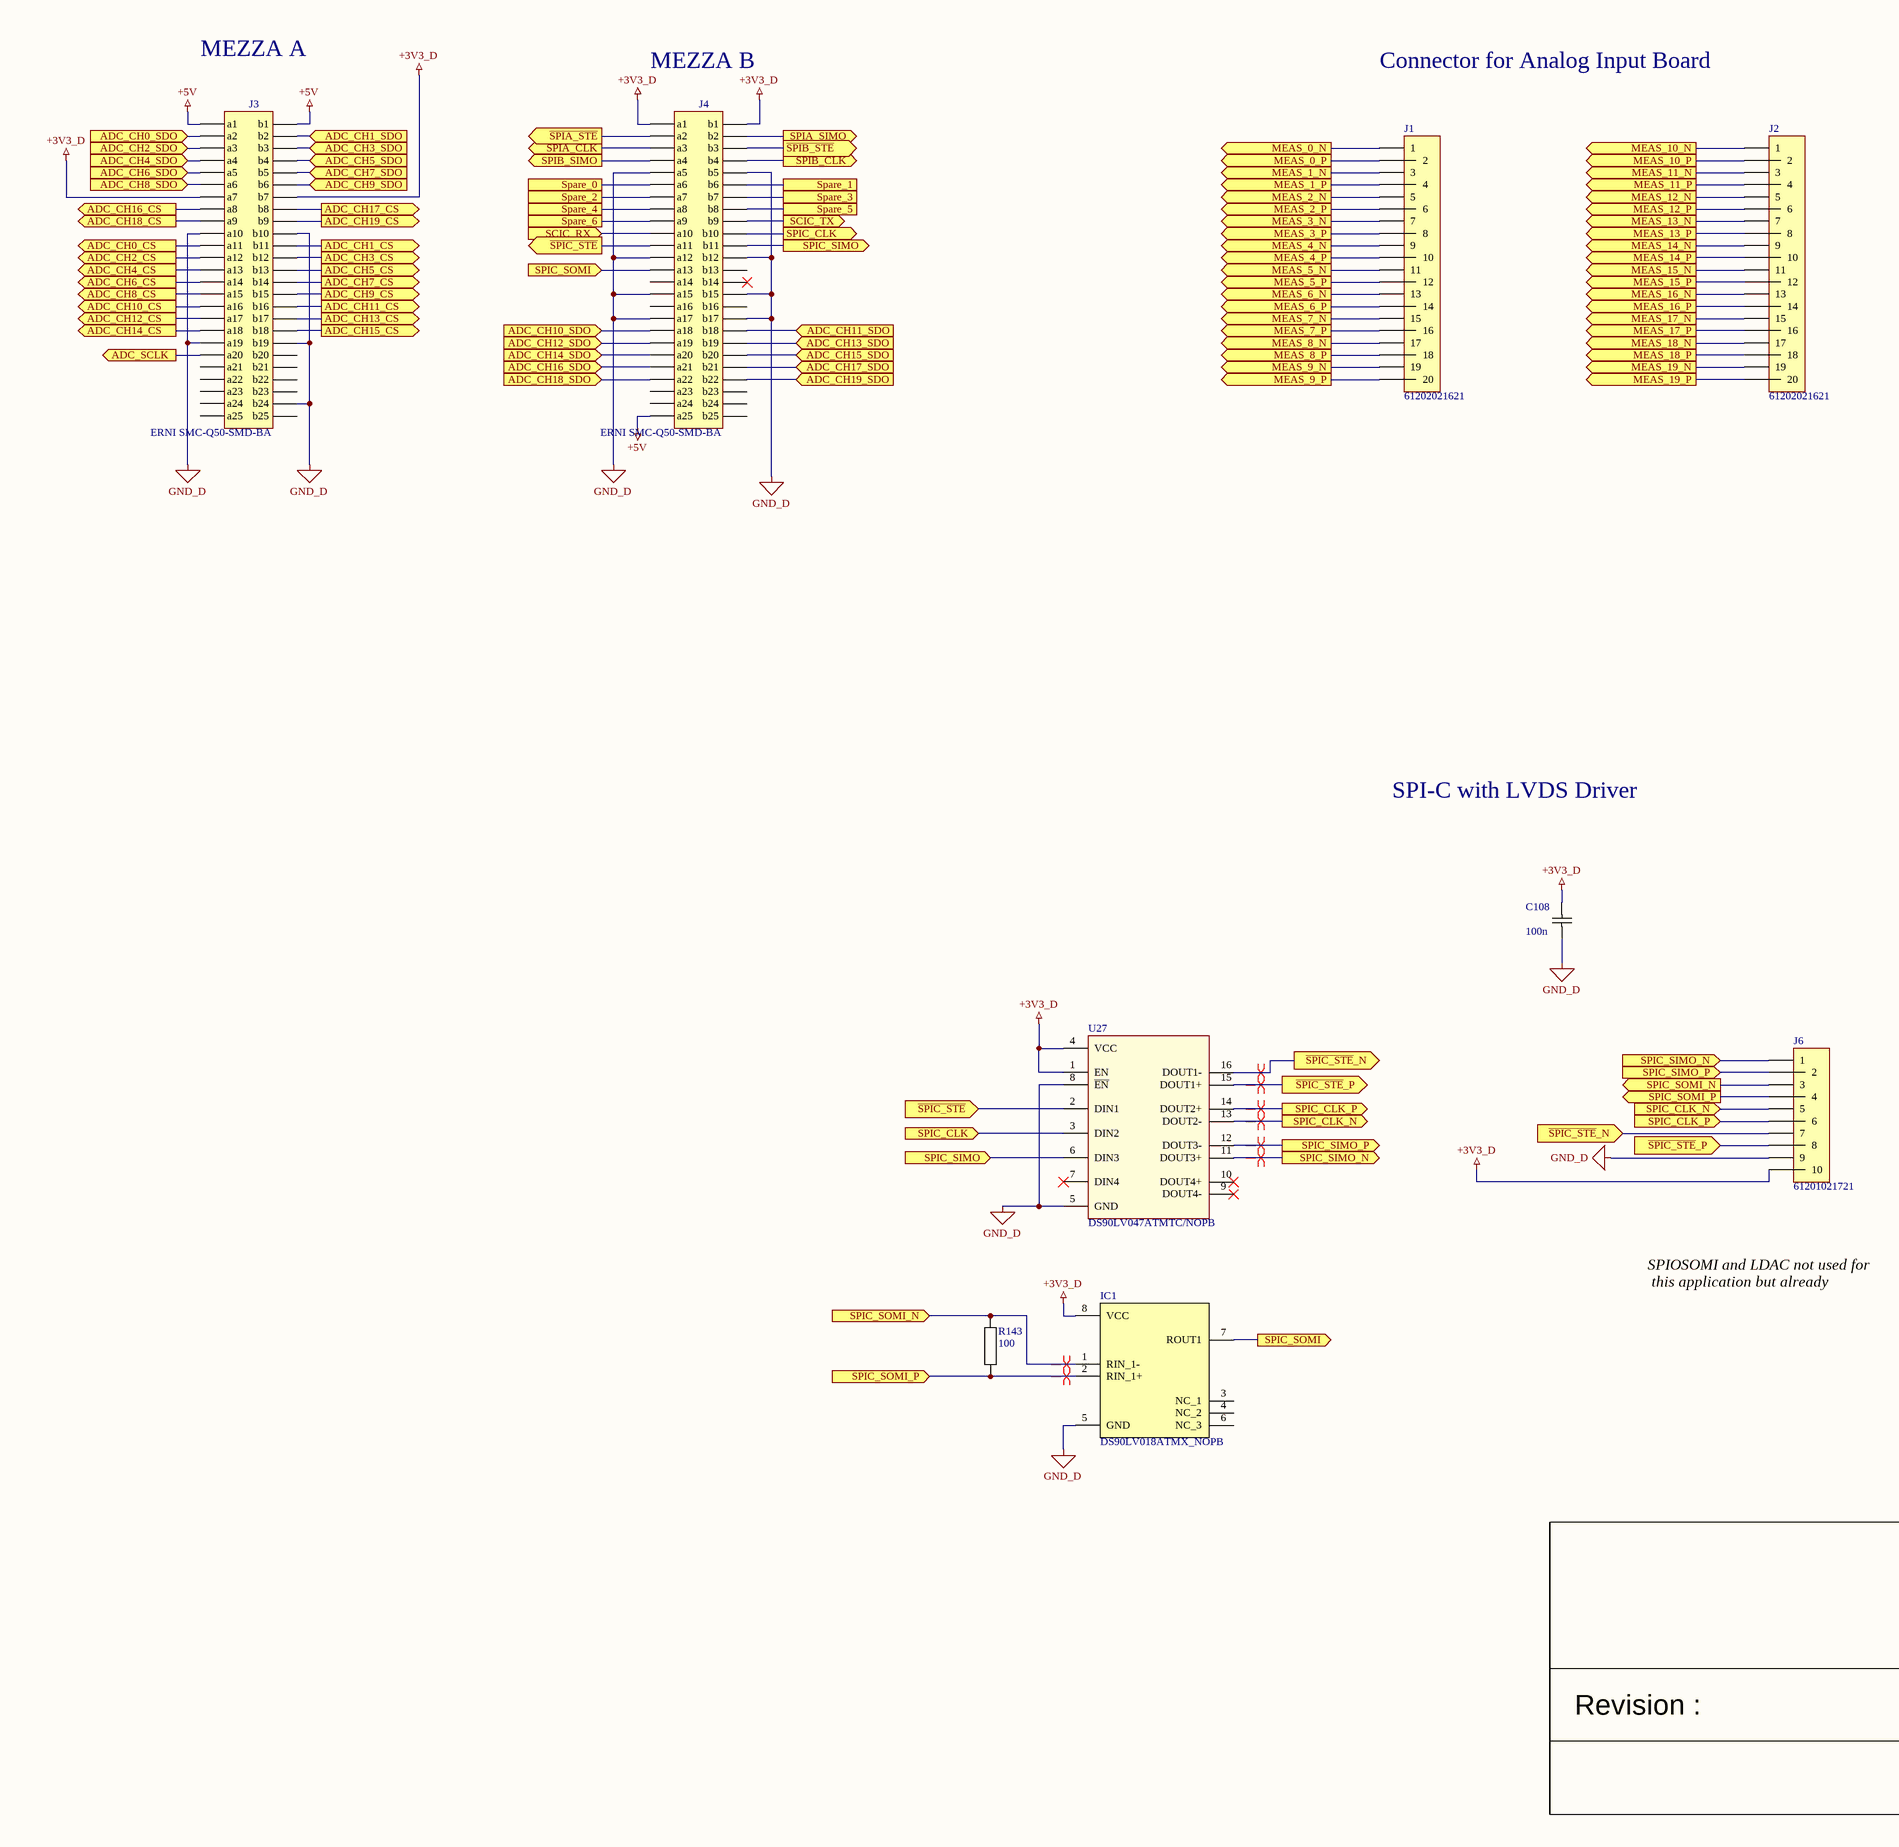
[diagram p6: Connector_0.SchDoc, left]
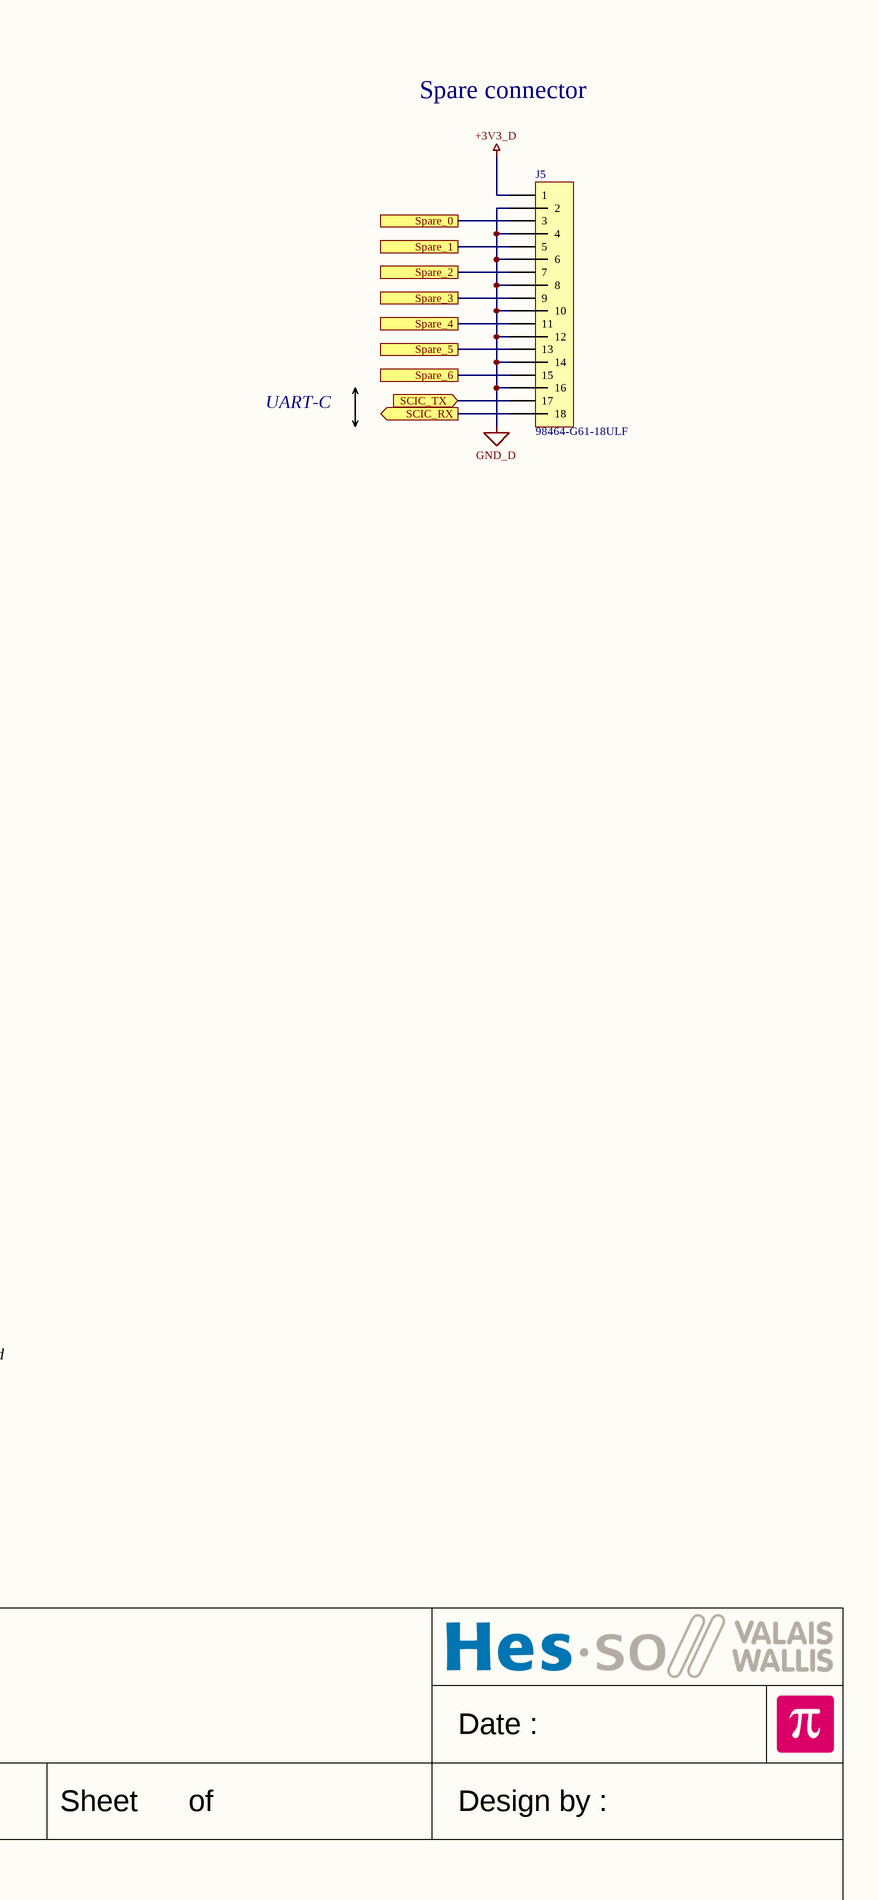
[diagram p7: Connector_0.SchDoc, right]

### Parts
C108  100n  [CAPACITOR 2012 REFLOW]
IC1  DS90LV018ATMX_NOPB  [SOIC127P600X175-8N]
J1  61202021621  [FlatCable2x10 2.54MM RIGHT ANGLE TH]
J2  61202021621  [FlatCable2x10 2.54MM RIGHT ANGLE TH]
J3  ERNI SMC-Q50-SMD-BA  [ERNI SMC-Q50-SMD-BA]
J4  ERNI SMC-Q50-SMD-BA  [ERNI SMC-Q50-SMD-BA]
J5  98464-G61-18ULF  [FlatCable2x9 2MM Straight SMD FCI 98414-G52-18ALF]
J6  61201021721  [FlatCable2x5 2.54MM Straight TH]
R143  100  [RESISTOR 1608 REFLOW]
U27  DS90LV047ATMTC/NOPB  [TSSOP16 P0.65 C5.0x4.5 H1.1]

### Ports
ADC_CH0_CS (out), ADC_CH0_SDO (in), ADC_CH1_CS (out), ADC_CH1_SDO (in), ADC_CH2_CS (out), ADC_CH2_SDO (in), ADC_CH3_CS (out), ADC_CH3_SDO (in), ADC_CH4_CS (out), ADC_CH4_SDO (in), ADC_CH5_CS (out), ADC_CH5_SDO (in), ADC_CH6_CS (out), ADC_CH6_SDO (in), ADC_CH7_CS (out), ADC_CH7_SDO (in), ADC_CH8_CS (out), ADC_CH8_SDO (in), ADC_CH9_CS (out), ADC_CH9_SDO (in), ADC_CH10_CS (out), ADC_CH10_SDO (in), ADC_CH11_CS (out), ADC_CH11_SDO (in), ADC_CH12_CS (out), ADC_CH12_SDO (in), ADC_CH13_CS (out), ADC_CH13_SDO (in), ADC_CH14_CS (out), ADC_CH14_SDO (in), ADC_CH15_CS (out), ADC_CH15_SDO (in), ADC_CH16_CS (out), ADC_CH16_SDO (in), ADC_CH17_CS (out), ADC_CH17_SDO (in), ADC_CH18_CS (out), ADC_CH18_SDO (in), ADC_CH19_CS (out), ADC_CH19_SDO (in), ADC_SCLK (out), MEAS_0_N (out), MEAS_0_P (out), MEAS_1_N (out), MEAS_1_P (out), MEAS_2_N (out), MEAS_2_P (out), MEAS_3_N (out), MEAS_3_P (out), MEAS_4_N (out), MEAS_4_P (out), MEAS_5_N (out), MEAS_5_P (out), MEAS_6_N (out), MEAS_6_P (out), MEAS_7_N (out), MEAS_7_P (out), MEAS_8_N (out), MEAS_8_P (out), MEAS_9_N (out), MEAS_9_P (out), MEAS_10_N (out), MEAS_10_P (out), MEAS_11_N (out), MEAS_11_P (out), MEAS_12_N (out), MEAS_12_P (out), MEAS_13_N (out), MEAS_13_P (out), MEAS_14_N (out), MEAS_14_P (out), MEAS_15_N (out), MEAS_15_P (out), MEAS_16_N (out), MEAS_16_P (out), MEAS_17_N (out), MEAS_17_P (out), MEAS_18_N (out), MEAS_18_P (out), MEAS_19_N (out), MEAS_19_P (out), SCIC_RX (in), SCIC_RX (out), SCIC_TX (in), SCIC_TX (out), Spare_0, Spare_1, Spare_2, Spare_3, Spare_4, Spare_5, Spare_6, SPIA_CLK (out), SPIA_SIMO (out), SPIB_CLK (out), SPIB_SIMO (out), SPIC_CLK (in), SPIC_CLK (out), SPIC_CLK_N (in), SPIC_CLK_N (out), SPIC_CLK_P (in), SPIC_CLK_P (out), SPIC_SIMO (in), SPIC_SIMO (out), SPIC_SIMO_N (in), SPIC_SIMO_N (out), SPIC_SIMO_P (in), SPIC_SIMO_P (out), SPIC_SOMI (in), SPIC_SOMI (out), SPIC_SOMI_N (in), SPIC_SOMI_N (out), SPIC_SOMI_P (in), SPIC_SOMI_P (out), ~{SPIA_STE} (out), ~{SPIB_STE} (out), ~{SPIC_STE} (in), ~{SPIC_STE} (out), ~{SPIC_STE}_N (in), ~{SPIC_STE}_N (out), ~{SPIC_STE}_P (in), ~{SPIC_STE}_P (out)

### Nets
+3V3_D: C108.2 IC1.8(VCC) J3.a7 J3.b7 J4.a1 J4.b1 J5.1 J6.10 U27.1(EN) U27.4(VCC)
+5V: J3.a1 J3.b1 J4.a25
GND_D: C108.1 IC1.5(GND) J3.a10 J3.a19 J3.b10 J3.b19 J3.b24 J4.a5 J4.a12 J4.a15 J4.a17 J4.b5 J4.b12 J4.b15 J4.b17 J5.2 J5.4 J5.6 J5.8 J5.10 J5.12 J5.14 J5.16 J6.9 U27.5(GND) U27.8(~{EN})
~{SPIA_STE}: J4.a2 ; port ~{SPIA_STE}
~{SPIB_STE}: J4.b3 ; port ~{SPIB_STE}
~{SPIC_STE}: J4.a11 U27.2(DIN1) ; port ~{SPIC_STE}
~{SPIC_STE}_N: J6.7 U27.16(DOUT1-) ; port ~{SPIC_STE}_N
~{SPIC_STE}_P: J6.8 U27.15(DOUT1+) ; port ~{SPIC_STE}_P
ADC_CH0_CS: J3.a11 ; port ADC_CH0_CS
ADC_CH0_SDO: J3.a2 ; port ADC_CH0_SDO
ADC_CH1_CS: J3.b11 ; port ADC_CH1_CS
ADC_CH1_SDO: J3.b2 ; port ADC_CH1_SDO
ADC_CH2_CS: J3.a12 ; port ADC_CH2_CS
ADC_CH2_SDO: J3.a3 ; port ADC_CH2_SDO
ADC_CH3_CS: J3.b12 ; port ADC_CH3_CS
ADC_CH3_SDO: J3.b3 ; port ADC_CH3_SDO
ADC_CH4_CS: J3.a13 ; port ADC_CH4_CS
ADC_CH4_SDO: J3.a4 ; port ADC_CH4_SDO
ADC_CH5_CS: J3.b13 ; port ADC_CH5_CS
ADC_CH5_SDO: J3.b4 ; port ADC_CH5_SDO
ADC_CH6_CS: J3.a14 ; port ADC_CH6_CS
ADC_CH6_SDO: J3.a5 ; port ADC_CH6_SDO
ADC_CH7_CS: J3.b14 ; port ADC_CH7_CS
ADC_CH7_SDO: J3.b5 ; port ADC_CH7_SDO
ADC_CH8_CS: J3.a15 ; port ADC_CH8_CS
ADC_CH8_SDO: J3.a6 ; port ADC_CH8_SDO
ADC_CH9_CS: J3.b15 ; port ADC_CH9_CS
ADC_CH9_SDO: J3.b6 ; port ADC_CH9_SDO
ADC_CH10_CS: J3.a16 ; port ADC_CH10_CS
ADC_CH10_SDO: J4.a18 ; port ADC_CH10_SDO
ADC_CH11_CS: J3.b16 ; port ADC_CH11_CS
ADC_CH11_SDO: J4.b18 ; port ADC_CH11_SDO
ADC_CH12_CS: J3.a17 ; port ADC_CH12_CS
ADC_CH12_SDO: J4.a19 ; port ADC_CH12_SDO
ADC_CH13_CS: J3.b17 ; port ADC_CH13_CS
ADC_CH13_SDO: J4.b19 ; port ADC_CH13_SDO
ADC_CH14_CS: J3.a18 ; port ADC_CH14_CS
ADC_CH14_SDO: J4.a20 ; port ADC_CH14_SDO
ADC_CH15_CS: J3.b18 ; port ADC_CH15_CS
ADC_CH15_SDO: J4.b20 ; port ADC_CH15_SDO
ADC_CH16_CS: J3.a8 ; port ADC_CH16_CS
ADC_CH16_SDO: J4.a21 ; port ADC_CH16_SDO
ADC_CH17_CS: J3.b8 ; port ADC_CH17_CS
ADC_CH17_SDO: J4.b21 ; port ADC_CH17_SDO
ADC_CH18_CS: J3.a9 ; port ADC_CH18_CS
ADC_CH18_SDO: J4.a22 ; port ADC_CH18_SDO
ADC_CH19_CS: J3.b9 ; port ADC_CH19_CS
ADC_CH19_SDO: J4.b22 ; port ADC_CH19_SDO
ADC_SCLK: J3.a20 ; port ADC_SCLK
MEAS_0_N: J1.1 ; port MEAS_0_N
MEAS_0_P: J1.2 ; port MEAS_0_P
MEAS_1_N: J1.3 ; port MEAS_1_N
MEAS_1_P: J1.4 ; port MEAS_1_P
MEAS_2_N: J1.5 ; port MEAS_2_N
MEAS_2_P: J1.6 ; port MEAS_2_P
MEAS_3_N: J1.7 ; port MEAS_3_N
MEAS_3_P: J1.8 ; port MEAS_3_P
MEAS_4_N: J1.9 ; port MEAS_4_N
MEAS_4_P: J1.10 ; port MEAS_4_P
MEAS_5_N: J1.11 ; port MEAS_5_N
MEAS_5_P: J1.12 ; port MEAS_5_P
MEAS_6_N: J1.13 ; port MEAS_6_N
MEAS_6_P: J1.14 ; port MEAS_6_P
MEAS_7_N: J1.15 ; port MEAS_7_N
MEAS_7_P: J1.16 ; port MEAS_7_P
MEAS_8_N: J1.17 ; port MEAS_8_N
MEAS_8_P: J1.18 ; port MEAS_8_P
MEAS_9_N: J1.19 ; port MEAS_9_N
MEAS_9_P: J1.20 ; port MEAS_9_P
MEAS_10_N: J2.1 ; port MEAS_10_N
MEAS_10_P: J2.2 ; port MEAS_10_P
MEAS_11_N: J2.3 ; port MEAS_11_N
MEAS_11_P: J2.4 ; port MEAS_11_P
MEAS_12_N: J2.5 ; port MEAS_12_N
MEAS_12_P: J2.6 ; port MEAS_12_P
MEAS_13_N: J2.7 ; port MEAS_13_N
MEAS_13_P: J2.8 ; port MEAS_13_P
MEAS_14_N: J2.9 ; port MEAS_14_N
MEAS_14_P: J2.10 ; port MEAS_14_P
MEAS_15_N: J2.11 ; port MEAS_15_N
MEAS_15_P: J2.12 ; port MEAS_15_P
MEAS_16_N: J2.13 ; port MEAS_16_N
MEAS_16_P: J2.14 ; port MEAS_16_P
MEAS_17_N: J2.15 ; port MEAS_17_N
MEAS_17_P: J2.16 ; port MEAS_17_P
MEAS_18_N: J2.17 ; port MEAS_18_N
MEAS_18_P: J2.18 ; port MEAS_18_P
MEAS_19_N: J2.19 ; port MEAS_19_N
MEAS_19_P: J2.20 ; port MEAS_19_P
SCIC_RX: J4.a10 J5.18 ; port SCIC_RX
SCIC_TX: J4.b9 J5.17 ; port SCIC_TX
Spare_0: J4.a6 J5.3 ; port Spare_0
Spare_1: J4.b6 J5.5 ; port Spare_1
Spare_2: J4.a7 J5.7 ; port Spare_2
Spare_3: J4.b7 J5.9 ; port Spare_3
Spare_4: J4.a8 J5.11 ; port Spare_4
Spare_5: J4.b8 J5.13 ; port Spare_5
Spare_6: J4.a9 J5.15 ; port Spare_6
SPIA_CLK: J4.a3 ; port SPIA_CLK
SPIA_SIMO: J4.b2 ; port SPIA_SIMO
SPIB_CLK: J4.b4 ; port SPIB_CLK
SPIB_SIMO: J4.a4 ; port SPIB_SIMO
SPIC_CLK: J4.b10 U27.3(DIN2) ; port SPIC_CLK
SPIC_CLK_N: J6.5 U27.13(DOUT2-) ; port SPIC_CLK_N
SPIC_CLK_P: J6.6 U27.14(DOUT2+) ; port SPIC_CLK_P
SPIC_SIMO: J4.b11 U27.6(DIN3) ; port SPIC_SIMO
SPIC_SIMO_N: J6.1 U27.11(DOUT3+) ; port SPIC_SIMO_N
SPIC_SIMO_P: J6.2 U27.12(DOUT3-) ; port SPIC_SIMO_P
SPIC_SOMI: IC1.7(ROUT1) J4.a13 ; port SPIC_SOMI
SPIC_SOMI_N: IC1.1(RIN_1-) J6.3 R143.1 ; port SPIC_SOMI_N
SPIC_SOMI_P: IC1.2(RIN_1+) J6.4 R143.2 ; port SPIC_SOMI_P

Not connected (* = marked no-connect by the designer): IC1 3(NC_1) 4(NC_2) 6(NC_3); J3 a21 a22 a23 a24 a25 b20 b21 b22 b23 b25; J4 a14 a16 a23 a24 b13 b14* b16 b23 b24 b25; U27 7(DIN4)* 9(DOUT4-)* 10(DOUT4+)*

### Layout directives
differential pair: SPIC_CLK_N, SPIC_CLK_P, SPIC_SIMO_N, SPIC_SIMO_P, SPIC_SOMI_N, SPIC_SOMI_P, ~{SPIC_STE}_N, ~{SPIC_STE}_P

### Notes on the sheet
- MEZZA A
- MEZZA B
- Connector for Analog Input Board
- Spare connector
- UART-C
- SPI-C with LVDS Driver
- SPIOSOMI and LDAC not used for
  this application but already reserved
- Date :
- Revision :
- Sheet
- of
- Design by :

### Library data of the parts
C108 = Capacitor: Capacitor X7R 10% 50V 2012(0805); Value: 100n
IC1 = DS90LV018ATMX_NOPB: Integrated Circuit; Manufacturer_Name: Texas Instruments; Manufacturer_Part_Number: DS90LV018ATMX/NOPB; Datasheet Link: http://www.ti.com/lit/gpn/ds90lv018a; Height: 1.75mm; Mouser Part Number: 926-DS90LV018ATMXNPB; Mouser Price/Stock: https://www.mouser.co.uk/ProductDetail/Texas-Instruments/DS90LV018ATMX-NOPB?qs=X1J7HmVL2ZGhGuL83KQT5g%3D%3D; Arrow Part Number: DS90LV018ATMX/NOPB; Arrow Price/Stock: https://www.arrow.com/en/products/ds90lv018atmxnopb/texas-instruments
J1 J2 = FlatCable2x10: Manufacturer: Wurth Elektronik; Mouser No.: 710-61202021621; Value: 61202021621
J3 J4 = ERNI SMC-Q50-SMD-BA: Male 1.27 pitch 2x25 pin connector
J5 = FlatCable2x9: Manufacturer: Amphenol FCI; Mouser No.: 649-98464-G61-18ULF; Value: 98464-G61-18ULF
J6 = FlatCable2x5: Manufacturer: Wurth Elektronik; Mouser No.: 710-61201021721; Value: 61201021721
R143 = Resistor: Resistor 1% 50V 100mW 1608(0603); Value: 100
U27 = DS90LV047A: DS90LV047A 3-V LVDS Quad CMOS Differential Line Driver; Manufacturer: Texas Instruments; Value: DS90LV047ATMTC/NOPB; Mouser No.: 926-DS90LV047ATMTCNO

## Sheet Supply_0.SchDoc
size A2; Date: Date; CompanyName: HESSO; Engineer: Name; Address1: Route du Rawyl 47; Address2: 1950 Sion; Address3: Switzerland; ProjectName: Project Name
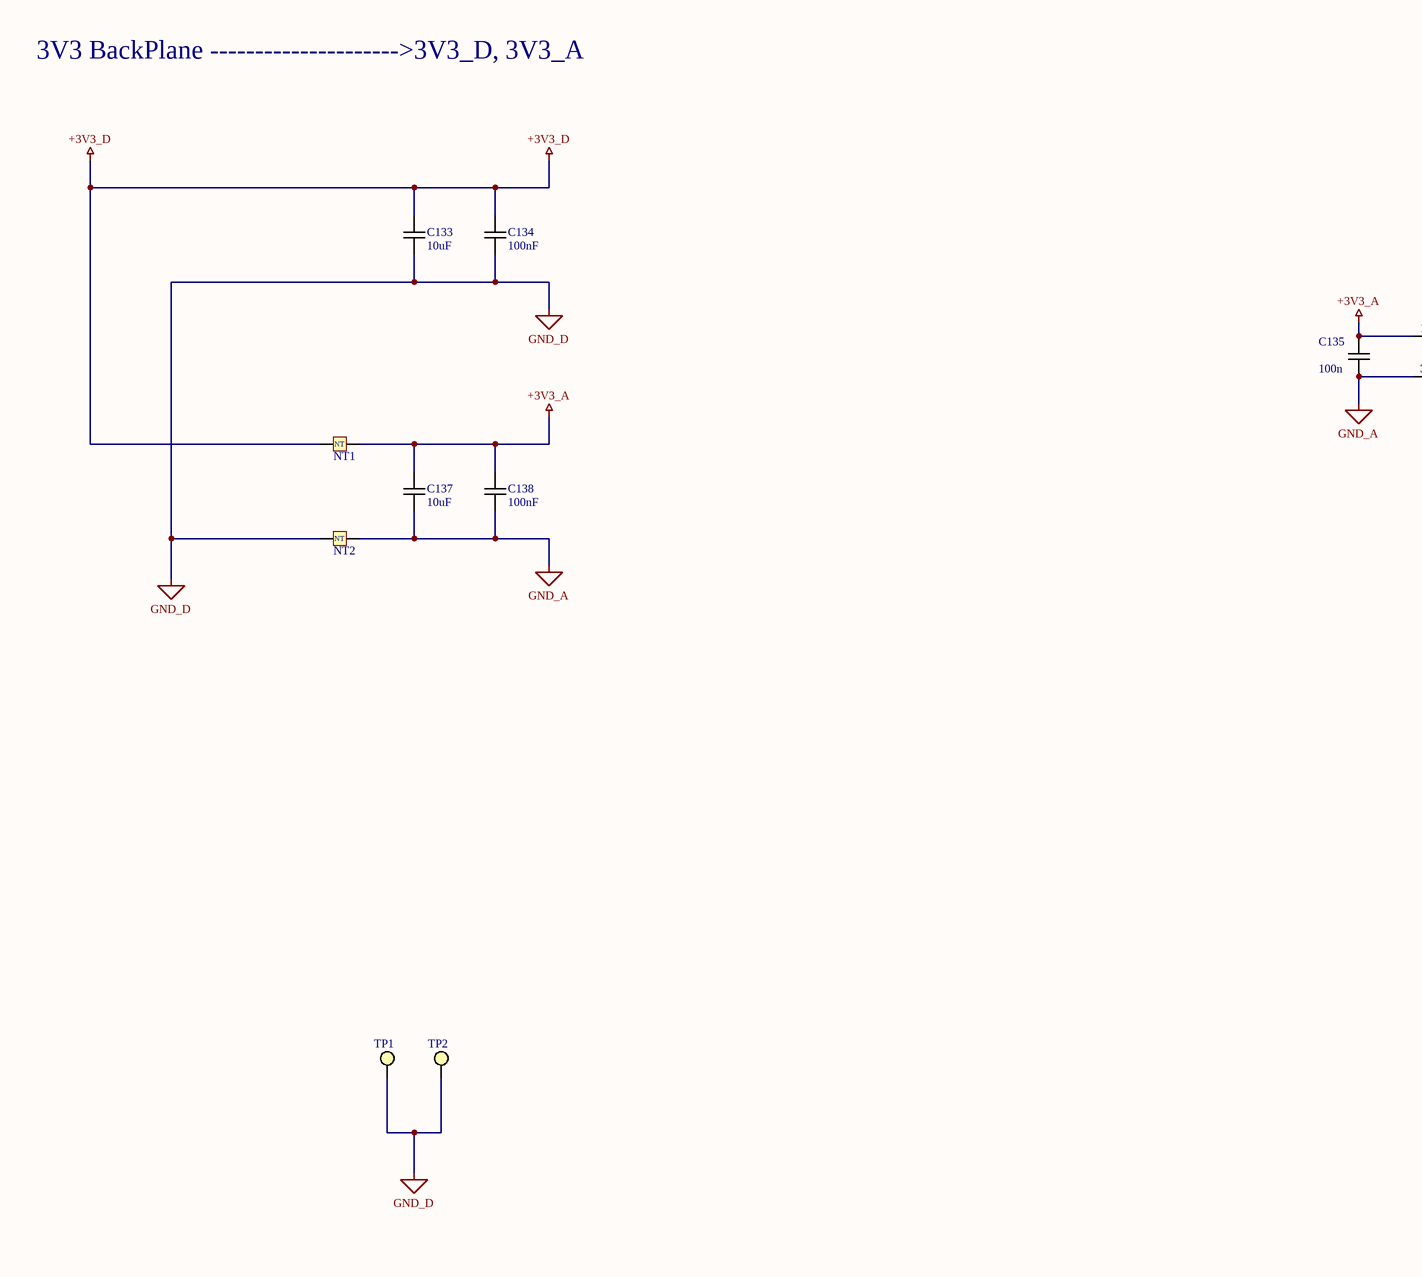
[diagram p8: Supply_0.SchDoc, left]
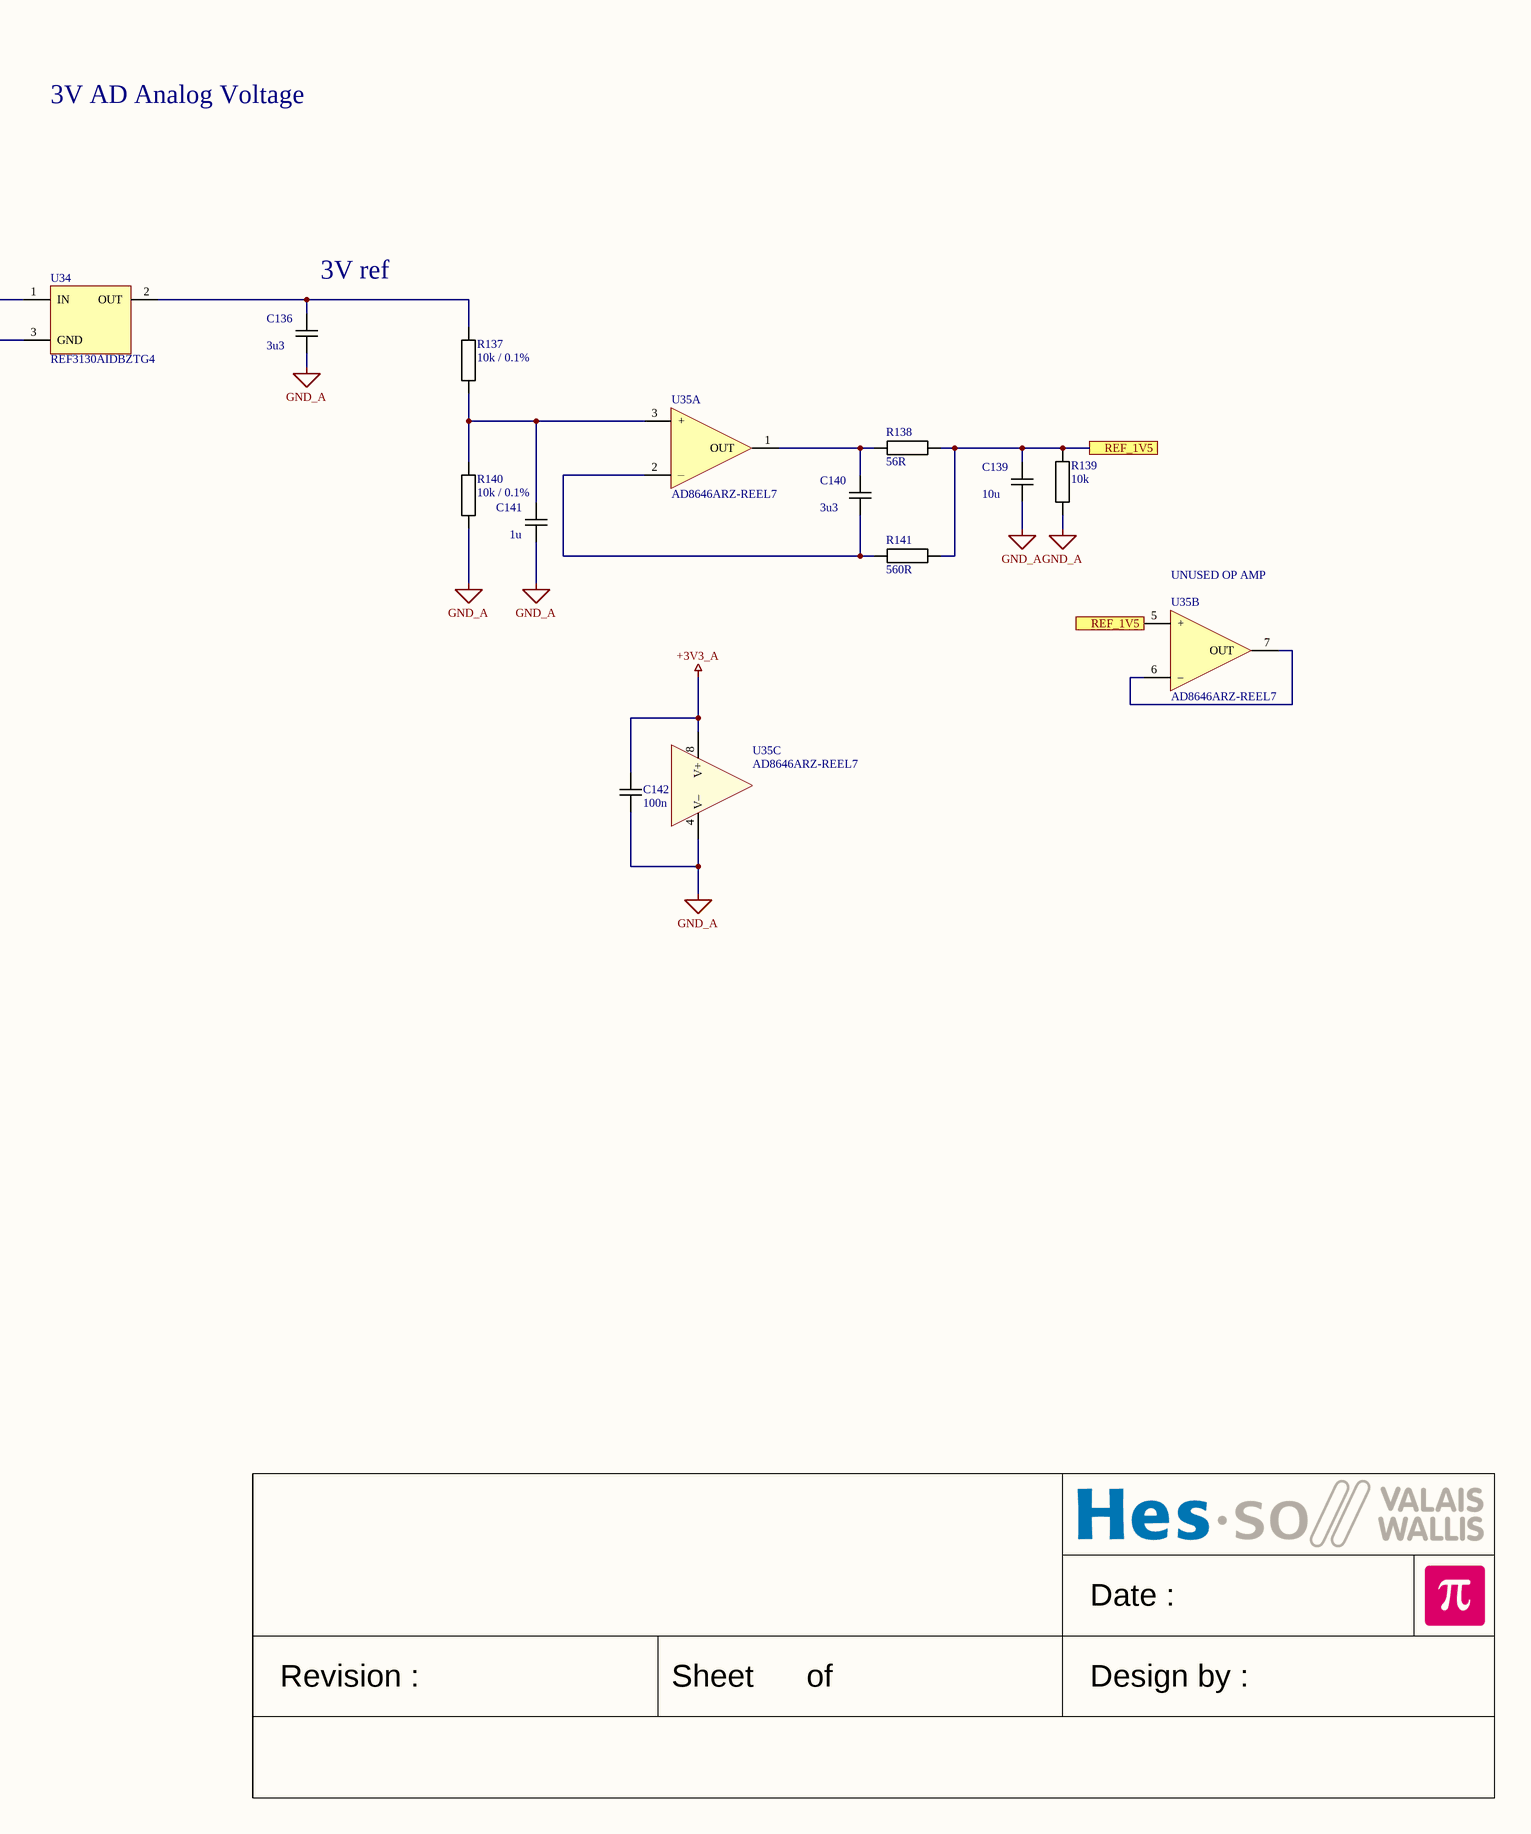
[diagram p9: Supply_0.SchDoc, right]

### Parts
C133  10uF  [CAPACITOR 2012 REFLOW]
C134  100nF  [CAPACITOR 2012 REFLOW]
C135  100n  [CAPACITOR 1608 REFLOW]
C136  3u3  [CAPACITOR 2012 REFLOW]
C137  10uF  [CAPACITOR 2012 REFLOW]
C138  100nF  [CAPACITOR 2012 REFLOW]
C139  10u  [CAPACITOR 2012 REFLOW]
C140  3u3  [CAPACITOR 2012 REFLOW]
C141  1u  [CAPACITOR 2012 REFLOW]
C142  100n  [CAPACITOR 1608 REFLOW]
NT1  Net Tie  [NET TIE 1005]  (value not drawn)  (net tie, no BOM)
NT2  Net Tie  [NET TIE 1005]  (value not drawn)  (net tie, no BOM)
R137  10k / 0.1%  [RESISTOR 1608 REFLOW]
R138  56R  [RESISTOR 1608 REFLOW]
R139  10k  [RESISTOR 1608 REFLOW]
R140  10k / 0.1%  [RESISTOR 1608 REFLOW]
R141  560R  [RESISTOR 1608 REFLOW]
TP1  *  [Test Point Keystone Miniature BLACK]  (value not drawn)
TP2  *  [Test Point Keystone Miniature BLACK]  (value not drawn)
U34  REF3130AIDBZTG4  [SOT23 P0.95 C1.6x3.0 H1.3]
U35  AD8646ARZ-REEL7  [SO8 P1.27 C4.0X5.0 H1.75]  (parts A,B,C of 3)

### Ports
REF_1V5

### Nets
+3V3_A: C135.2 C137.1 C138.1 C142.2 NT1.2 U34.1(IN) U35.8(V+)
+3V3_D: C133.1 C134.1 NT1.1
GND_A: C135.1 C136.1 C137.2 C138.2 C139.1 C141.1 C142.1 NT2.2 R139.2 R140.2 U34.3(GND) U35.4(V–)
GND_D: C133.2 C134.2 NT2.1 TP1.1 TP2.1
REF_1V5: C139.2 R138.1 R139.1 R141.1 U35.5(+) ; port REF_1V5
NetC136_2: C136.2 R137.2 U34.2(OUT)
NetC140_1: C140.1 R141.2 U35.2(–)
NetC140_2: C140.2 R138.2 U35.1(OUT)
NetC141_2: C141.2 R137.1 R140.1 U35.3(+)
NetU35_6: U35.6(–) U35.7(OUT)

### Notes on the sheet
- 3V3 BackPlane --------------------->3V3_D, 3V3_A
- 3V AD Analog Voltage
- (near C136) 3V ref
- (near U35) UNUSED OP AMP
- Date :
- Revision :
- Sheet
- of
- Design by :
- (in symbol Net Tie) NT

### Library data of the parts
C133 C136 C137 C139-C141 = Capacitor: Capacitor X7R 10% 10V 2012(0805)
  C133 C137: Value: 10uF
  C136 C140: Value: 3u3
  C139: Value: 10u
  C141: Value: 1u
C134 C138 = Capacitor: Capacitor X7R 10% 50V 2012(0805); Value: 100nF
C135 C142 = Capacitor: Capacitor X7R 10% 50V 1608(0603); Value: 100n
NT1 NT2 = Net Tie: Connection for 2 different NETNAME
R137-R141 = Resistor: Resistor 1% 50V 100mW 1608(0603)
  R137 R140: Value: 10k / 0.1%
  R138: Value: 56R
  R139: Value: 10k
  R141: Value: 560R
TP1 TP2 = Test Point: Value: *
U34 = REFERENCE SOT23 IN,OUT,GND: Generic Positive Voltage Reference; Value: REF3130AIDBZTG4
U35 = OPA DUAL: Generic dual OPA 8 pins; Manufacturer: Analog Devices; Value: AD8646ARZ-REEL7; Mouser No.: 584-AD8646ARZ-R7

## Sheet DAC_0.SchDoc
size A2; Date: Date; CompanyName: HESSO; Engineer: Name; Address1: Route du Rawyl 47; Address2: 1950 Sion; Address3: Switzerland; ProjectName: Project Name
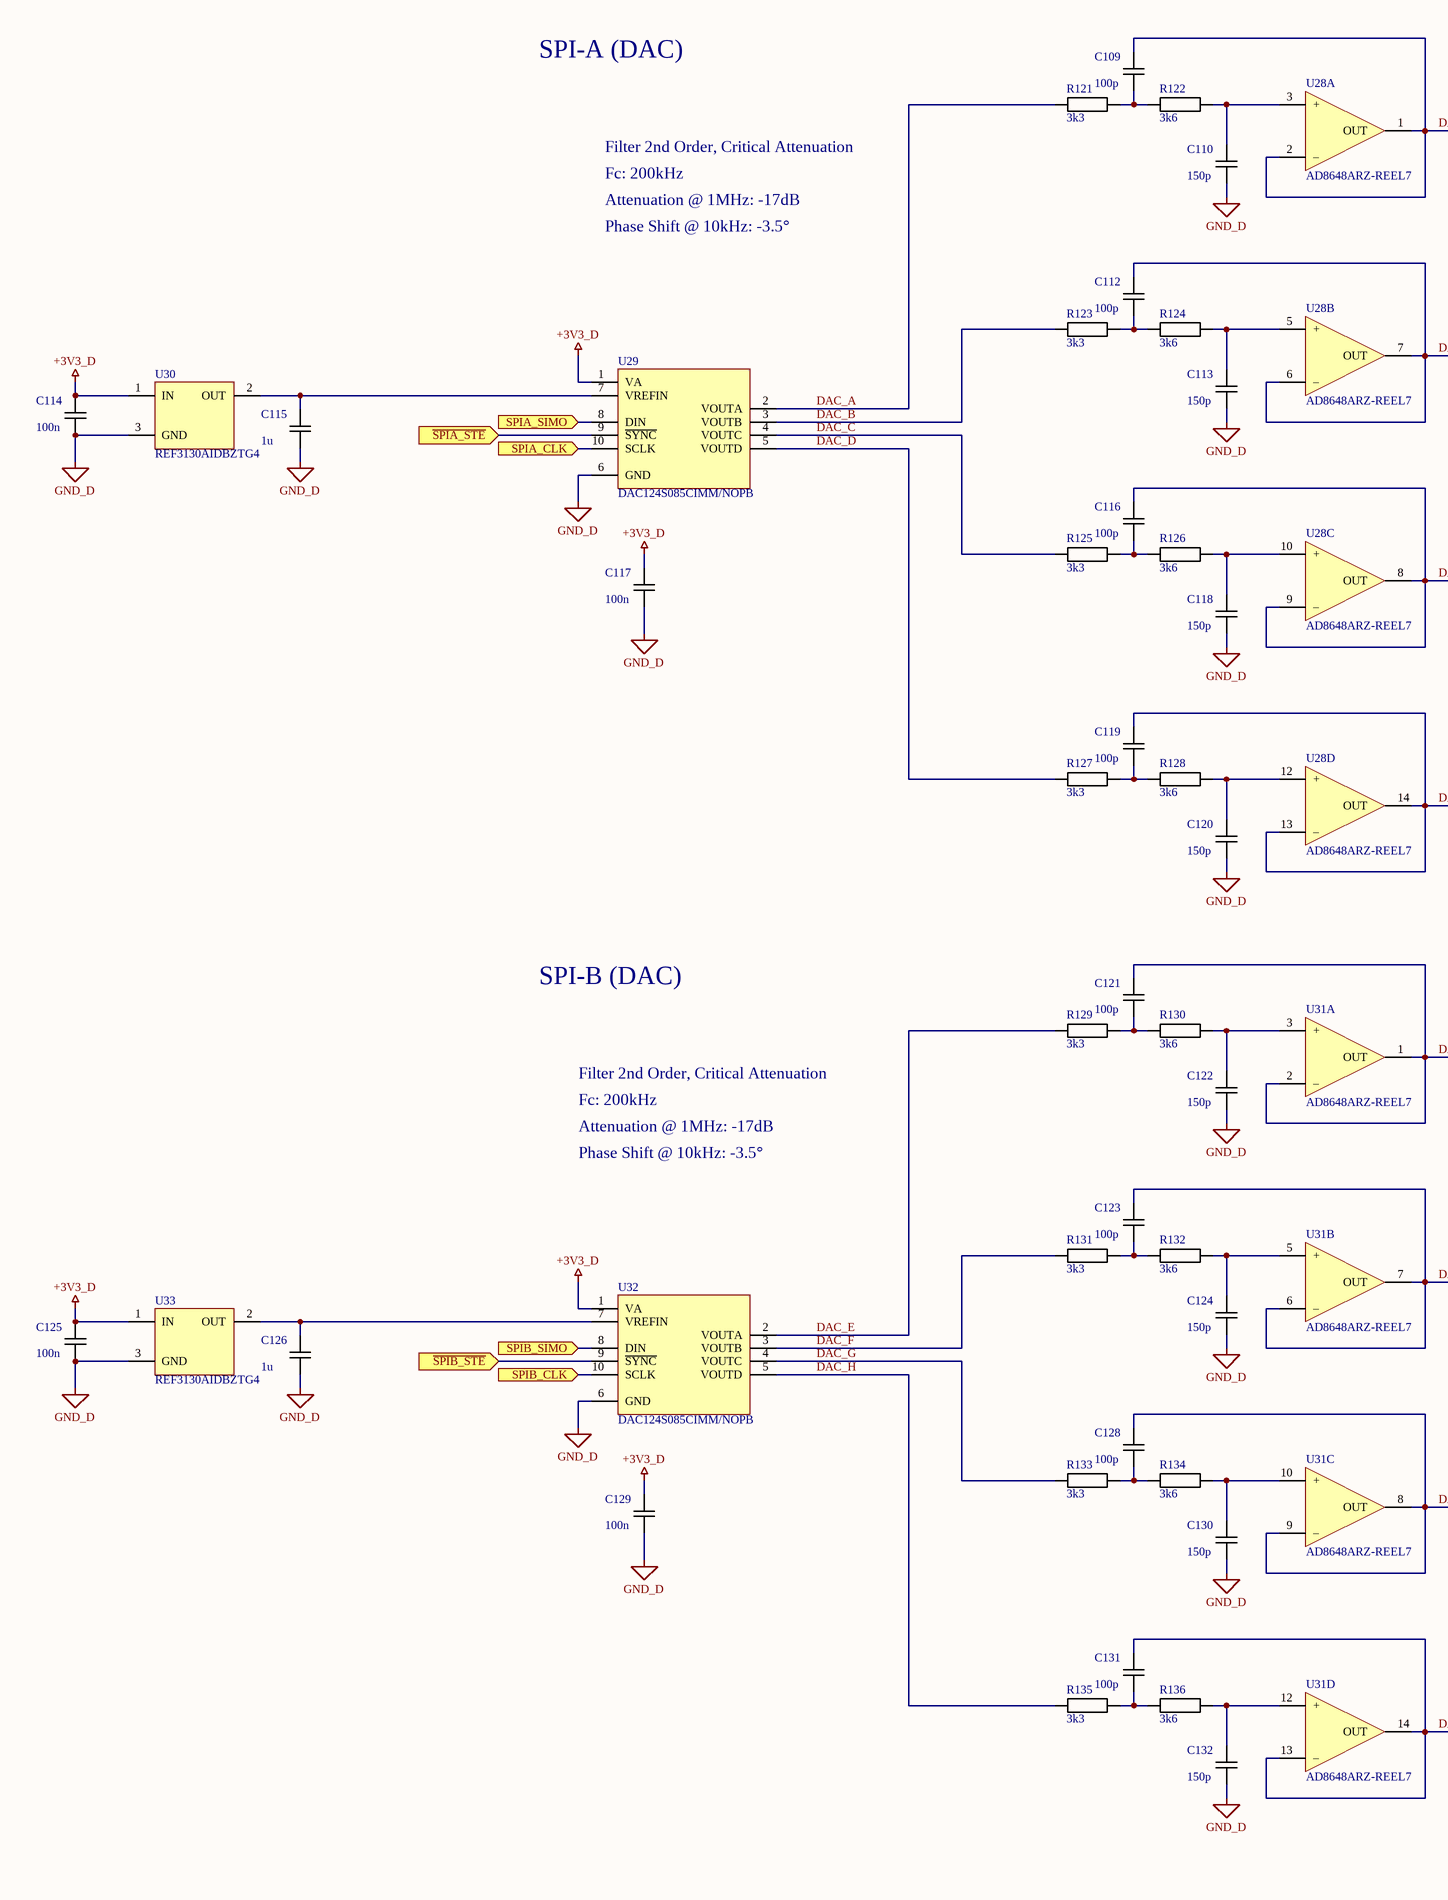
[diagram p10: DAC_0.SchDoc, left]
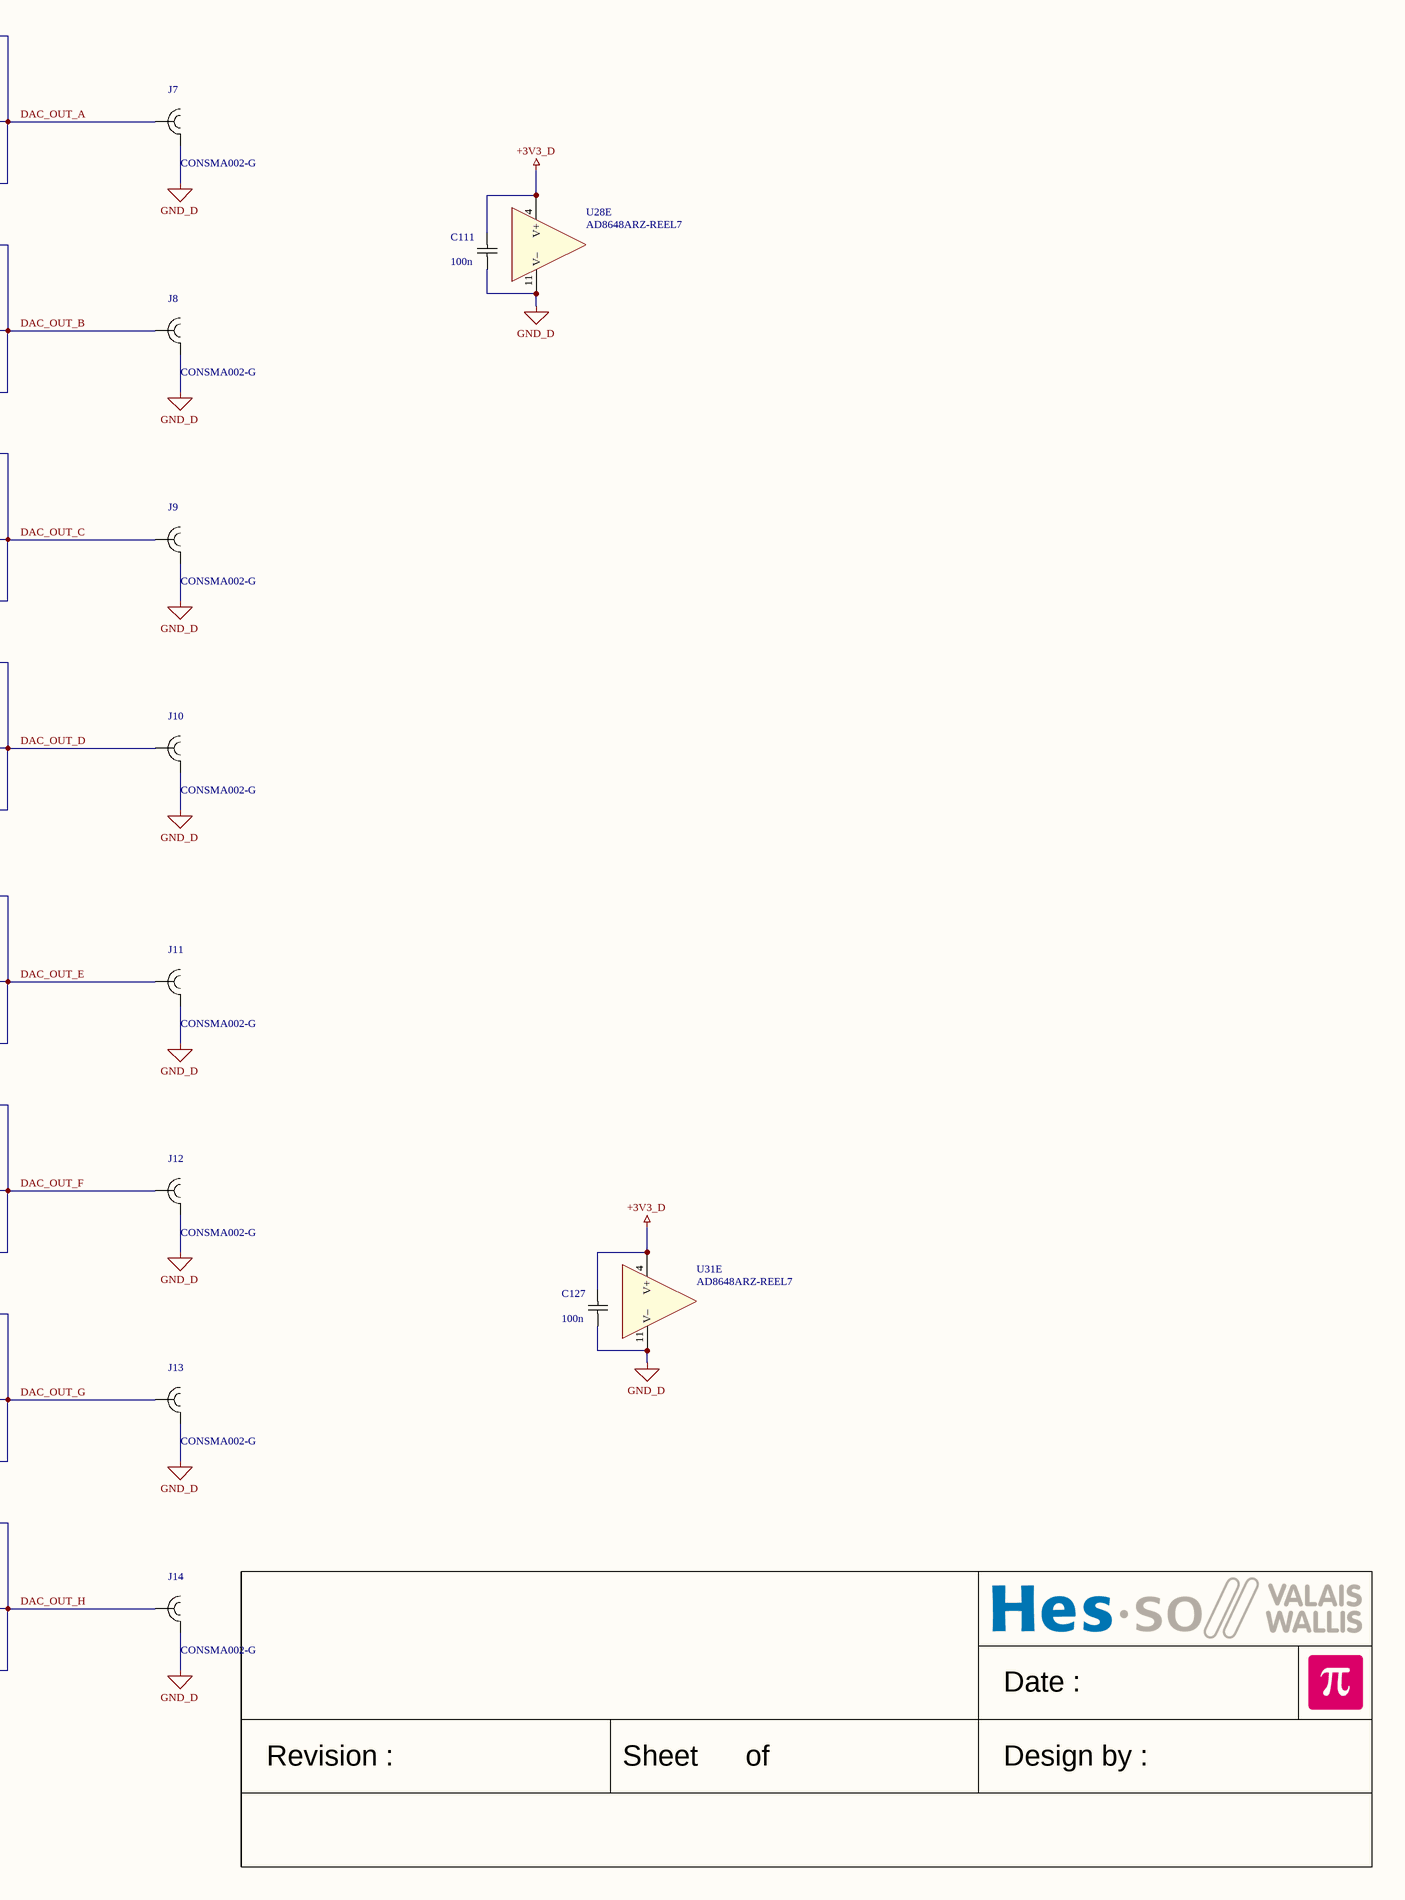
[diagram p11: DAC_0.SchDoc, right]

### Parts
C109  100p  [CAPACITOR 2012 REFLOW]
C110  150p  [CAPACITOR 2012 REFLOW]
C111  100n  [CAPACITOR 1608 REFLOW]
C112  100p  [CAPACITOR 2012 REFLOW]
C113  150p  [CAPACITOR 2012 REFLOW]
C114  100n  [CAPACITOR 2012 REFLOW]
C115  1u  [CAPACITOR 2012 REFLOW]
C116  100p  [CAPACITOR 2012 REFLOW]
C117  100n  [CAPACITOR 1608 REFLOW]
C118  150p  [CAPACITOR 2012 REFLOW]
C119  100p  [CAPACITOR 2012 REFLOW]
C120  150p  [CAPACITOR 2012 REFLOW]
C121  100p  [CAPACITOR 2012 REFLOW]
C122  150p  [CAPACITOR 2012 REFLOW]
C123  100p  [CAPACITOR 2012 REFLOW]
C124  150p  [CAPACITOR 2012 REFLOW]
C125  100n  [CAPACITOR 2012 REFLOW]
C126  1u  [CAPACITOR 2012 REFLOW]
C127  100n  [CAPACITOR 1608 REFLOW]
C128  100p  [CAPACITOR 2012 REFLOW]
C129  100n  [CAPACITOR 1608 REFLOW]
C130  150p  [CAPACITOR 2012 REFLOW]
C131  100p  [CAPACITOR 2012 REFLOW]
C132  150p  [CAPACITOR 2012 REFLOW]
J7  CONSMA002-G  [SMA TH Right Angle Linx CONSMA002]
J8  CONSMA002-G  [SMA TH Right Angle Linx CONSMA002]
J9  CONSMA002-G  [SMA TH Right Angle Linx CONSMA002]
J10  CONSMA002-G  [SMA TH Right Angle Linx CONSMA002]
J11  CONSMA002-G  [SMA TH Right Angle Linx CONSMA002]
J12  CONSMA002-G  [SMA TH Right Angle Linx CONSMA002]
J13  CONSMA002-G  [SMA TH Right Angle Linx CONSMA002]
J14  CONSMA002-G  [SMA TH Right Angle Linx CONSMA002]
R121  3k3  [RESISTOR 2012 REFLOW]
R122  3k6  [RESISTOR 2012 REFLOW]
R123  3k3  [RESISTOR 2012 REFLOW]
R124  3k6  [RESISTOR 2012 REFLOW]
R125  3k3  [RESISTOR 2012 REFLOW]
R126  3k6  [RESISTOR 2012 REFLOW]
R127  3k3  [RESISTOR 2012 REFLOW]
R128  3k6  [RESISTOR 2012 REFLOW]
R129  3k3  [RESISTOR 2012 REFLOW]
R130  3k6  [RESISTOR 2012 REFLOW]
R131  3k3  [RESISTOR 2012 REFLOW]
R132  3k6  [RESISTOR 2012 REFLOW]
R133  3k3  [RESISTOR 2012 REFLOW]
R134  3k6  [RESISTOR 2012 REFLOW]
R135  3k3  [RESISTOR 2012 REFLOW]
R136  3k6  [RESISTOR 2012 REFLOW]
U28  AD8648ARZ-REEL7  [SO14 P1.27 C4.0X8.8 H1.75]  (parts A,B,C,D,E of 5)
U29  DAC124S085CIMM/NOPB  [VSSOP10 P0.5 C3.1X3.1 H1.1]
U30  REF3130AIDBZTG4  [SOT23 P0.95 C1.6x3.0 H1.3]
U31  AD8648ARZ-REEL7  [SO14 P1.27 C4.0X8.8 H1.75]  (parts A,B,C,D,E of 5)
U32  DAC124S085CIMM/NOPB  [VSSOP10 P0.5 C3.1X3.1 H1.1]
U33  REF3130AIDBZTG4  [SOT23 P0.95 C1.6x3.0 H1.3]

### Ports
SPIA_CLK (in), SPIA_SIMO (in), SPIB_CLK (in), SPIB_SIMO (in), ~{SPIA_STE} (in), ~{SPIB_STE} (in)

### Nets
+3V3_D: C111.2 C114.2 C117.2 C125.2 C127.2 C129.2 U28.4(V+) U29.1(VA) U30.1(IN) U31.4(V+) U32.1(VA) U33.1(IN)
GND_D: C110.1 C111.1 C113.1 C114.1 C115.1 C117.1 C118.1 C120.1 C122.1 C124.1 C125.1 C126.1 C127.1 C129.1 C130.1 C132.1 J7.2 J8.2 J9.2 J10.2 J11.2 J12.2 J13.2 J14.2 U28.11(V–) U29.6(GND) U30.3(GND) U31.11(V–) U32.6(GND) U33.3(GND)
~{SPIA_STE}: U29.9(~{SYNC}) ; port ~{SPIA_STE}
~{SPIB_STE}: U32.9(~{SYNC}) ; port ~{SPIB_STE}
DAC_A: R121.1 U29.2(VOUTA)
DAC_B: R123.1 U29.3(VOUTB)
DAC_C: R125.1 U29.4(VOUTC)
DAC_D: R127.1 U29.5(VOUTD)
DAC_E: R129.1 U32.2(VOUTA)
DAC_F: R131.1 U32.3(VOUTB)
DAC_G: R133.1 U32.4(VOUTC)
DAC_H: R135.1 U32.5(VOUTD)
DAC_OUT_A: C109.2 J7.1 U28.1(OUT) U28.2(–)
DAC_OUT_B: C112.2 J8.1 U28.6(–) U28.7(OUT)
DAC_OUT_C: C116.2 J9.1 U28.8(OUT) U28.9(–)
DAC_OUT_D: C119.2 J10.1 U28.13(–) U28.14(OUT)
DAC_OUT_E: C121.2 J11.1 U31.1(OUT) U31.2(–)
DAC_OUT_F: C123.2 J12.1 U31.6(–) U31.7(OUT)
DAC_OUT_G: C128.2 J13.1 U31.8(OUT) U31.9(–)
DAC_OUT_H: C131.2 J14.1 U31.13(–) U31.14(OUT)
SPIA_CLK: U29.10(SCLK) ; port SPIA_CLK
SPIA_SIMO: U29.8(DIN) ; port SPIA_SIMO
SPIB_CLK: U32.10(SCLK) ; port SPIB_CLK
SPIB_SIMO: U32.8(DIN) ; port SPIB_SIMO
NetC109_1: C109.1 R121.2 R122.1
NetC110_2: C110.2 R122.2 U28.3(+)
NetC112_1: C112.1 R123.2 R124.1
NetC113_2: C113.2 R124.2 U28.5(+)
NetC115_2: C115.2 U29.7(VREFIN) U30.2(OUT)
NetC116_1: C116.1 R125.2 R126.1
NetC118_2: C118.2 R126.2 U28.10(+)
NetC119_1: C119.1 R127.2 R128.1
NetC120_2: C120.2 R128.2 U28.12(+)
NetC121_1: C121.1 R129.2 R130.1
NetC122_2: C122.2 R130.2 U31.3(+)
NetC123_1: C123.1 R131.2 R132.1
NetC124_2: C124.2 R132.2 U31.5(+)
NetC126_2: C126.2 U32.7(VREFIN) U33.2(OUT)
NetC128_1: C128.1 R133.2 R134.1
NetC130_2: C130.2 R134.2 U31.10(+)
NetC131_1: C131.1 R135.2 R136.1
NetC132_2: C132.2 R136.2 U31.12(+)

### Notes on the sheet
- SPI-A (DAC)
- Filter 2nd Order, Critical Attenuation
- Fc: 200kHz
- Attenuation @ 1MHz: -17dB
- Phase Shift @ 10kHz: -3.5°
- SPI-B (DAC)
- Date :
- Revision :
- Sheet
- of
- Design by :

### Library data of the parts
C109 C110 C112-C114 C116 C118-C125 C128 C130-C132 = Capacitor: Capacitor X7R 10% 50V 2012(0805)
  C109 C112 C116 C119 C121 C123 C128 C131: Value: 100p
  C110 C113 C118 C120 C122 C124 C130 C132: Value: 150p
  C114 C125: Value: 100n
C111 C117 C127 C129 = Capacitor: Capacitor X7R 10% 50V 1608(0603); Value: 100n
C115 C126 = Capacitor: Capacitor X7R 10% 10V 2012(0805); Value: 1u
J7-J14 = SMA TH RIGHT ANGLE LINX CONSMA002: Manufacturer: Linx Technologies; Value: CONSMA002-G; Mouser No.: 712-CONSMA002-G
R121-R136 = Resistor: Resistor 1% 50V 125mW 2012(0805)
  R121 R123 R125 R127 R129 R131 R133 R135: Value: 3k3
  R122 R124 R126 R128 R130 R132 R134 R136: Value: 3k6
U28 U31 = OPA QUAD: Generic quad OPA 14 pins; Manufacturer: Analog Devices; Value: AD8648ARZ-REEL7; Mouser No.: 584-AD8648ARZ-R7
U29 U32 = DAC124S085CIMM: DAC124S085 12-Bit Micro Power Quad Digital-to-Analog Converter With Rail-to-Rail Output; Manufacturer: Texas Instruments; Value: DAC124S085CIMM/NOPB; Mouser No.: 926-DAC124S085CIMMNO
U30 U33 = REFERENCE SOT23 IN,OUT,GND: Generic Positive Voltage Reference; Value: REF3130AIDBZTG4

## Nets that join several sheets
+3V3_A: AD_0 (6 pins), AD_1 (C50.2 C53.2 U4.4 U5.4), Supply_0 (7 pins)
+3V3_D: Connector_0 (10 pins), Supply_0 (C133.1 C134.1 NT1.1), DAC_0 (12 pins)
+5V: AD_3 (C66.2 TP3.1 U24.2 U24.3), Connector_0 (J3.a1 J3.b1 J4.a25)
GND_A: AD_0 (54 pins), AD_1 (36 pins), AD_3 (63 pins), Supply_0 (12 pins)
GND_D: Connector_0 (26 pins), Supply_0 (5 pins), DAC_0 (30 pins)
~{SPIA_STE}: Connector_0 (J4.a2), DAC_0 (U29.9)
~{SPIB_STE}: Connector_0 (J4.b3), DAC_0 (U32.9)
ADC_CH0: AD_1 (C62.2 R109.2 R113.2 R117.1), AD_3 (U20.3)
ADC_CH0_CS: AD_3 (U20.6), Connector_0 (J3.a11)
ADC_CH0_SDO: AD_3 (U20.5), Connector_0 (J3.a2)
ADC_CH1: AD_0 (C4.2 R1.2 R7.2 R13.1), AD_3 (U6.3)
ADC_CH1_CS: AD_3 (U6.6), Connector_0 (J3.b11)
ADC_CH1_SDO: AD_3 (U6.5), Connector_0 (J3.b2)
ADC_CH2: AD_0 (C13.2 R19.2 R25.2 R31.1), AD_3 (U9.3)
ADC_CH2_CS: AD_3 (U9.6), Connector_0 (J3.a12)
ADC_CH2_SDO: AD_3 (U9.5), Connector_0 (J3.a3)
ADC_CH3: AD_0 (C6.2 R3.2 R9.2 R15.1), AD_3 (U12.3)
ADC_CH3_CS: AD_3 (U12.6), Connector_0 (J3.b12)
ADC_CH3_SDO: AD_3 (U12.5), Connector_0 (J3.b3)
ADC_CH4: AD_0 (C15.2 R21.2 R27.2 R33.1), AD_3 (U15.3)
ADC_CH4_CS: AD_3 (U15.6), Connector_0 (J3.a13)
ADC_CH4_SDO: AD_3 (U15.5), Connector_0 (J3.a4)
ADC_CH5: AD_0 (C22.2 R37.2 R43.2 R49.1), AD_3 (U18.3)
ADC_CH5_CS: AD_3 (U18.6), Connector_0 (J3.b13)
ADC_CH5_SDO: AD_3 (U18.5), Connector_0 (J3.b4)
ADC_CH6: AD_0 (C31.2 R55.2 R61.2 R67.1), AD_3 (U21.3)
ADC_CH6_CS: AD_3 (U21.6), Connector_0 (J3.a14)
ADC_CH6_SDO: AD_3 (U21.5), Connector_0 (J3.a5)
ADC_CH7: AD_0 (C23.2 R38.2 R44.2 R50.1), AD_3 (U23.3)
ADC_CH7_CS: AD_3 (U23.6), Connector_0 (J3.b14)
ADC_CH7_SDO: AD_3 (U23.5), Connector_0 (J3.b5)
ADC_CH8: AD_0 (C33.2 R57.2 R63.2 R69.1), AD_3 (U25.3)
ADC_CH8_CS: AD_3 (U25.6), Connector_0 (J3.a15)
ADC_CH8_SDO: AD_3 (U25.5), Connector_0 (J3.a6)
ADC_CH9: AD_0 (C5.2 R2.2 R8.2 R14.1), AD_3 (U26.3)
ADC_CH9_CS: AD_3 (U26.6), Connector_0 (J3.b15)
ADC_CH9_SDO: AD_3 (U26.5), Connector_0 (J3.b6)
ADC_CH10: AD_0 (C14.2 R20.2 R26.2 R32.1), AD_3 (U7.3)
ADC_CH10_CS: AD_3 (U7.6), Connector_0 (J3.a16)
ADC_CH10_SDO: AD_3 (U7.5), Connector_0 (J4.a18)
ADC_CH11: AD_0 (C24.2 R39.2 R45.2 R51.1), AD_3 (U10.3)
ADC_CH11_CS: AD_3 (U10.6), Connector_0 (J3.b16)
ADC_CH11_SDO: AD_3 (U10.5), Connector_0 (J4.b18)
ADC_CH12: AD_0 (C32.2 R56.2 R62.2 R68.1), AD_3 (U13.3)
ADC_CH12_CS: AD_3 (U13.6), Connector_0 (J3.a17)
ADC_CH12_SDO: AD_3 (U13.5), Connector_0 (J4.a19)
ADC_CH13: AD_1 (C43.2 R74.2 R78.2 R82.1), AD_3 (U16.3)
ADC_CH13_CS: AD_3 (U16.6), Connector_0 (J3.b17)
ADC_CH13_SDO: AD_3 (U16.5), Connector_0 (J4.b19)
ADC_CH14: AD_1 (C49.2 R86.2 R90.2 R94.1), AD_3 (U19.3)
ADC_CH14_CS: AD_3 (U19.6), Connector_0 (J3.a18)
ADC_CH14_SDO: AD_3 (U19.5), Connector_0 (J4.a20)
ADC_CH15: AD_1 (C42.2 R73.2 R77.2 R81.1), AD_3 (U22.3)
ADC_CH15_CS: AD_3 (U22.6), Connector_0 (J3.b18)
ADC_CH15_SDO: AD_3 (U22.5), Connector_0 (J4.b20)
ADC_CH16: AD_1 (C48.2 R85.2 R89.2 R93.1), AD_3 (U8.3)
ADC_CH16_CS: AD_3 (U8.6), Connector_0 (J3.a8)
ADC_CH16_SDO: AD_3 (U8.5), Connector_0 (J4.a21)
ADC_CH17: AD_1 (C57.2 R98.2 R102.2 R106.1), AD_3 (U11.3)
ADC_CH17_CS: AD_3 (U11.6), Connector_0 (J3.b8)
ADC_CH17_SDO: AD_3 (U11.5), Connector_0 (J4.b21)
ADC_CH18: AD_1 (C63.2 R110.2 R114.2 R118.1), AD_3 (U14.3)
ADC_CH18_CS: AD_3 (U14.6), Connector_0 (J3.a9)
ADC_CH18_SDO: AD_3 (U14.5), Connector_0 (J4.a22)
ADC_CH19: AD_1 (C56.2 R97.2 R101.2 R105.1), AD_3 (U17.3)
ADC_CH19_CS: AD_3 (U17.6), Connector_0 (J3.b9)
ADC_CH19_SDO: AD_3 (U17.5), Connector_0 (J4.b22)
ADC_SCLK: AD_3 (20 pins), Connector_0 (J3.a20)
MEAS_0_N: AD_1 (R111.1), Connector_0 (J1.1)
MEAS_0_P: AD_1 (R115.1), Connector_0 (J1.2)
MEAS_1_N: AD_0 (R4.1), Connector_0 (J1.3)
MEAS_1_P: AD_0 (R10.1), Connector_0 (J1.4)
MEAS_2_N: AD_0 (R22.1), Connector_0 (J1.5)
MEAS_2_P: AD_0 (R28.1), Connector_0 (J1.6)
MEAS_3_N: AD_0 (R6.1), Connector_0 (J1.7)
MEAS_3_P: AD_0 (R12.1), Connector_0 (J1.8)
MEAS_4_N: AD_0 (R24.1), Connector_0 (J1.9)
MEAS_4_P: AD_0 (R30.1), Connector_0 (J1.10)
MEAS_5_N: AD_0 (R40.1), Connector_0 (J1.11)
MEAS_5_P: AD_0 (R46.1), Connector_0 (J1.12)
MEAS_6_N: AD_0 (R58.1), Connector_0 (J1.13)
MEAS_6_P: AD_0 (R64.1), Connector_0 (J1.14)
MEAS_7_N: AD_0 (R41.1), Connector_0 (J1.15)
MEAS_7_P: AD_0 (R47.1), Connector_0 (J1.16)
MEAS_8_N: AD_0 (R60.1), Connector_0 (J1.17)
MEAS_8_P: AD_0 (R66.1), Connector_0 (J1.18)
MEAS_9_N: AD_0 (R5.1), Connector_0 (J1.19)
MEAS_9_P: AD_0 (R11.1), Connector_0 (J1.20)
MEAS_10_N: AD_0 (R23.1), Connector_0 (J2.1)
MEAS_10_P: AD_0 (R29.1), Connector_0 (J2.2)
MEAS_11_N: AD_0 (R42.1), Connector_0 (J2.3)
MEAS_11_P: AD_0 (R48.1), Connector_0 (J2.4)
MEAS_12_N: AD_0 (R59.1), Connector_0 (J2.5)
MEAS_12_P: AD_0 (R65.1), Connector_0 (J2.6)
MEAS_13_N: AD_1 (R76.1), Connector_0 (J2.7)
MEAS_13_P: AD_1 (R80.1), Connector_0 (J2.8)
MEAS_14_N: AD_1 (R88.1), Connector_0 (J2.9)
MEAS_14_P: AD_1 (R92.1), Connector_0 (J2.10)
MEAS_15_N: AD_1 (R75.1), Connector_0 (J2.11)
MEAS_15_P: AD_1 (R79.1), Connector_0 (J2.12)
MEAS_16_N: AD_1 (R87.1), Connector_0 (J2.13)
MEAS_16_P: AD_1 (R91.1), Connector_0 (J2.14)
MEAS_17_N: AD_1 (R100.1), Connector_0 (J2.15)
MEAS_17_P: AD_1 (R104.1), Connector_0 (J2.16)
MEAS_18_N: AD_1 (R112.1), Connector_0 (J2.17)
MEAS_18_P: AD_1 (R116.1), Connector_0 (J2.18)
MEAS_19_N: AD_1 (R99.1), Connector_0 (J2.19)
MEAS_19_P: AD_1 (R103.1), Connector_0 (J2.20)
REF_1V5: AD_0 (12 pins), AD_1 (8 pins), Supply_0 (5 pins)
SPIA_CLK: Connector_0 (J4.a3), DAC_0 (U29.10)
SPIA_SIMO: Connector_0 (J4.b2), DAC_0 (U29.8)
SPIB_CLK: Connector_0 (J4.b4), DAC_0 (U32.10)
SPIB_SIMO: Connector_0 (J4.a4), DAC_0 (U32.8)